# EAGLE design pokey (EAGLE 6.6.0)

## Sheet 1 of 7: Paddles
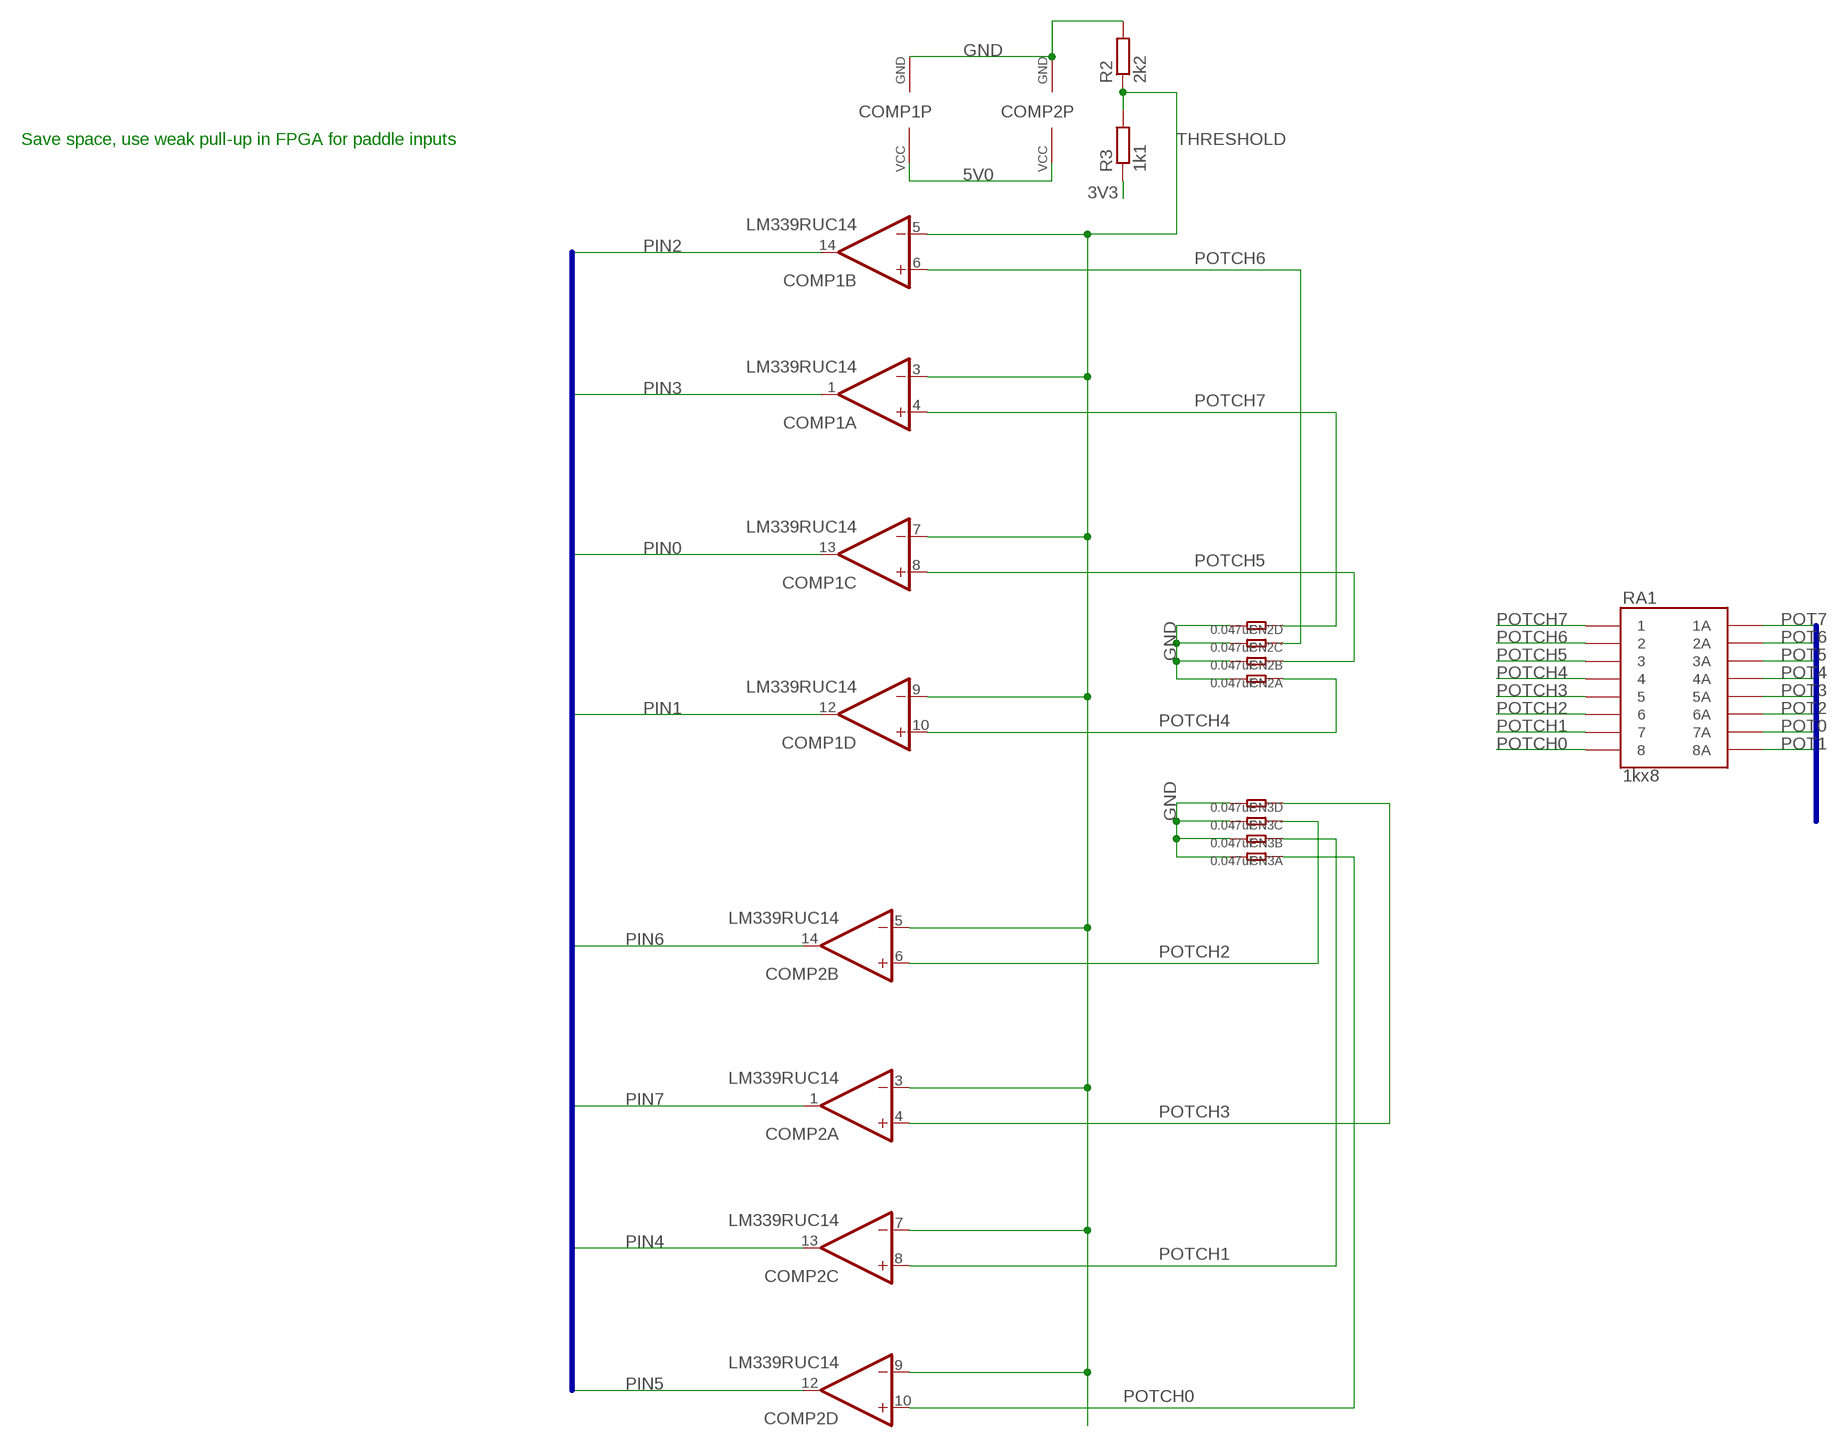
[diagram p0: schematic, sheet 1]

### Parts
CN2  0.047uF  R-4R  [R1206-8]
CN3  0.047uF  R-4R  [R1206-8]
COMP1  LM339RUC14  [RUC14]
COMP2  LM339RUC14  [RUC14]
R2  2k2  R-EU_R0603  [R0603]
R3  1k1  R-EU_R0603  [R0603]
RA1  1kx8  CAY16-J8  [CAY16-J8]

### Nets
3V3: R3.1 ; also sheet 2,3,4,7
5V0: COMP1.2(P:VCC) COMP2.2(P:VCC) ; also sheet 3,4,5,7
GND: CN2.5 CN2.6 CN2.7 CN2.8 CN3.5 CN3.6 CN3.7 CN3.8 COMP1.11(P:GND) COMP2.11(P:GND) R2.2 ; also sheet 2,3,4,5,6,7
PIN0: COMP1.13(C:OUT) ; also sheet 2
PIN1: COMP1.12(D:OUT) ; also sheet 2
PIN2: COMP1.14(B:OUT) ; also sheet 2
PIN3: COMP1.1(A:OUT) ; also sheet 2
PIN4: COMP2.13(C:OUT) ; also sheet 2
PIN5: COMP2.12(D:OUT) ; also sheet 2
PIN6: COMP2.14(B:OUT) ; also sheet 2
PIN7: COMP2.1(A:OUT) ; also sheet 2
POT0: RA1.P$10(7A) ; also sheet 3
POT1: RA1.P$9(8A) ; also sheet 3
POT2: RA1.P$11(6A) ; also sheet 3
POT3: RA1.P$12(5A) ; also sheet 3
POT4: RA1.P$13(4A) ; also sheet 3
POT5: RA1.P$14(3A) ; also sheet 3
POT6: RA1.P$15(2A) ; also sheet 3
POT7: RA1.P$16(1A) ; also sheet 3
POTCH0: CN3.1 COMP2.10(D:+IN) RA1.P$8 ; also sheet 3
POTCH1: CN3.2 COMP2.8(C:+IN) RA1.P$7 ; also sheet 3
POTCH2: CN3.3 COMP2.6(B:+IN) RA1.P$6 ; also sheet 3
POTCH3: CN3.4 COMP2.4(A:+IN) RA1.P$5 ; also sheet 3
POTCH4: CN2.1 COMP1.10(D:+IN) RA1.P$4 ; also sheet 3
POTCH5: CN2.2 COMP1.8(C:+IN) RA1.P$3 ; also sheet 3
POTCH6: CN2.3 COMP1.6(B:+IN) RA1.P$2 ; also sheet 3
POTCH7: CN2.4 COMP1.4(A:+IN) RA1.P$1 ; also sheet 3
THRESHOLD: COMP1.3(A:-IN) COMP1.5(B:-IN) COMP1.7(C:-IN) COMP1.9(D:-IN) COMP2.3(A:-IN) COMP2.5(B:-IN) COMP2.7(C:-IN) COMP2.9(D:-IN) R2.1 R3.2

### Buses
POT[0..7]
PIN[0..7]

### Notes on the sheet
- Save space, use weak pull-up in FPGA for paddle inputs

## Sheet 2 of 7: FPGA
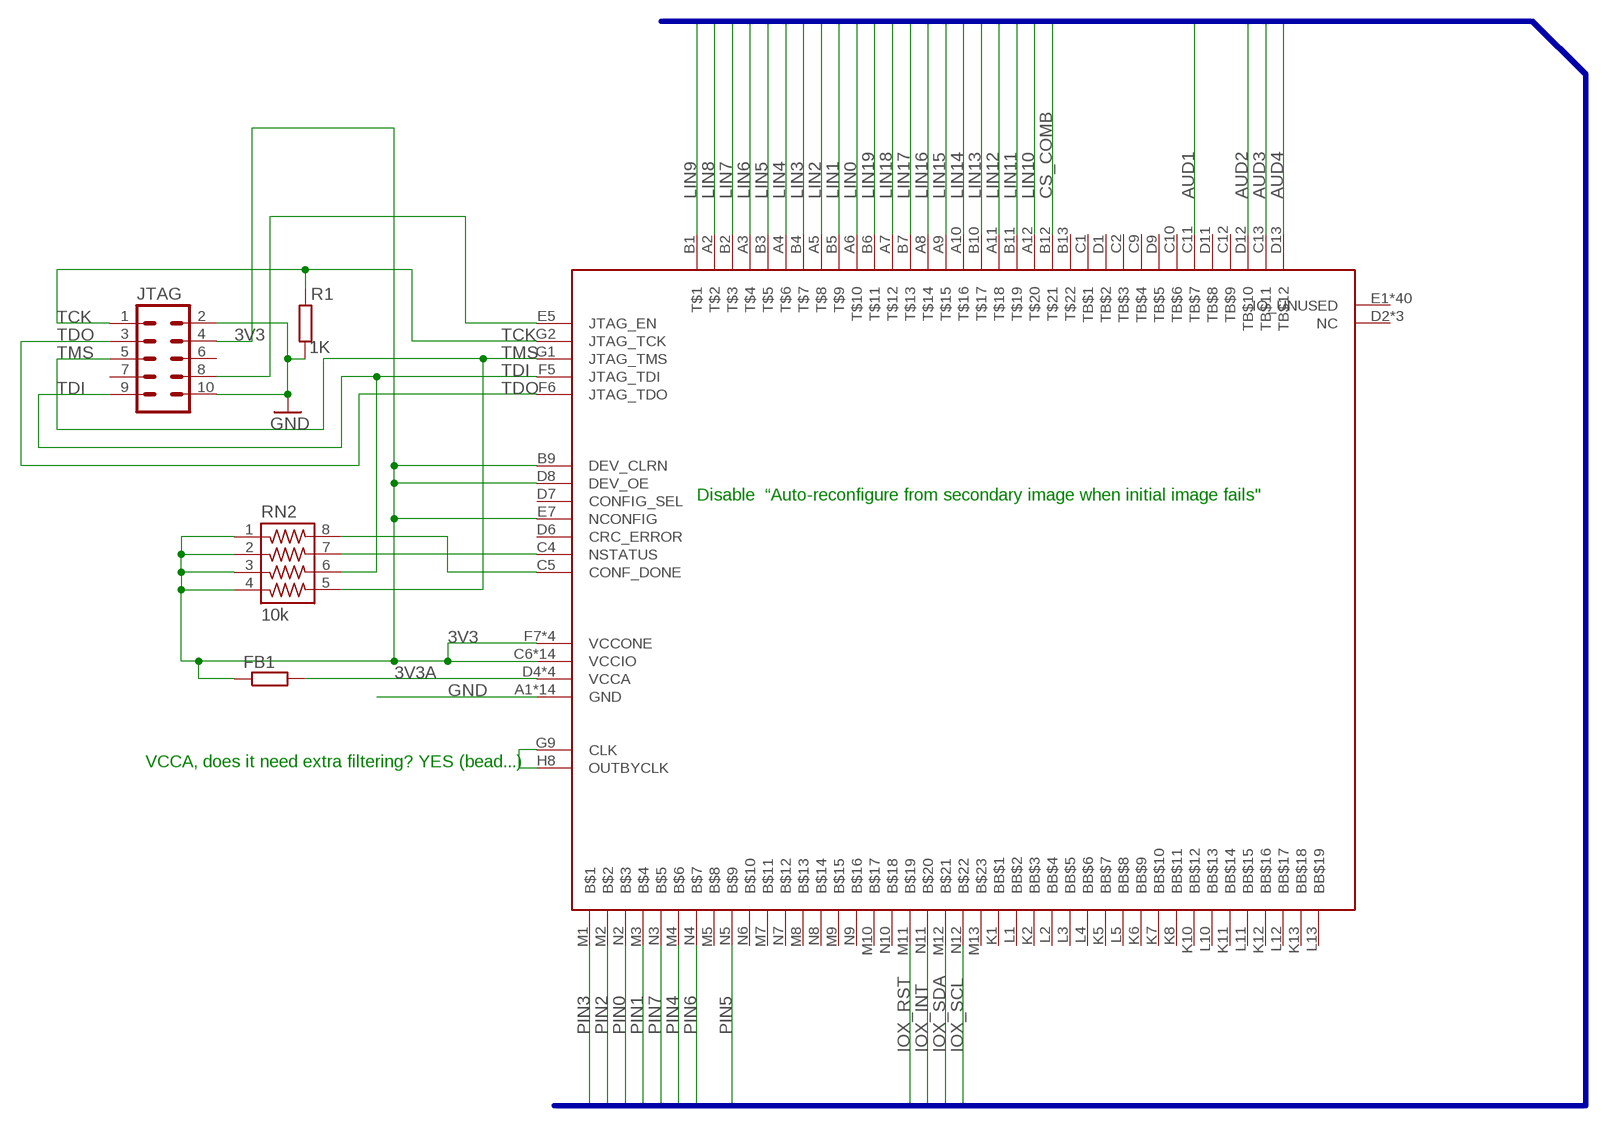
[diagram p1: schematic, sheet 2]

### Parts
FB1  R-EU_R0603  [R0603]
JTAG  ML10  [ML10]
MAX10  MAX10  [U169SMALL]
R1  1K  R-EU_R0603  [R0603]
RN2  10k  742-8  [742-8]

### Nets
3V3: FB1.1 JTAG.4 MAX10.B9(DEV_CLRN) MAX10.C6(VCCIO) MAX10.C7(VCCIO) MAX10.C8(VCCIO) MAX10.D8(DEV_OE) MAX10.E7(NCONFIG) MAX10.F2(VCCIO) MAX10.F7(VCCONE) MAX10.F11(VCCIO) MAX10.G3(VCCIO) MAX10.G6(VCCONE) MAX10.G8(VCCONE) MAX10.G11(VCCIO) MAX10.H7(VCCONE) MAX10.H11(VCCIO) MAX10.J3(VCCIO) MAX10.J11(VCCIO) MAX10.K3(VCCIO) MAX10.L6(VCCIO) MAX10.L7(VCCIO) MAX10.L8(VCCIO) RN2.1 RN2.2 RN2.3 RN2.4 ; also sheet 1,3,4,7
3V3A: FB1.2 MAX10.D4(VCCA) MAX10.D10(VCCA) MAX10.K4(VCCA) MAX10.K9(VCCA) ; also sheet 7
AUD1: MAX10.C11(TB$7) ; also sheet 6
AUD2: MAX10.D12(TB$10) ; also sheet 6
AUD3: MAX10.C13(TB$11) ; also sheet 6
AUD4: MAX10.D13(TB$12) ; also sheet 6
CONF_DONE: MAX10.C5(CONF_DONE) RN2.8
CS_COMB: MAX10.B12(T$21) ; also sheet 3
FAKE_CLK: MAX10.G9(CLK) MAX10.H8(OUTBYCLK)
GND: JTAG.2 JTAG.10 MAX10.A1(GND) MAX10.A13(GND) MAX10.B8(GND) MAX10.C3(GND) MAX10.D5(GND) MAX10.E11(GND) MAX10.F3(GND) MAX10.G7(GND) MAX10.H12(GND) MAX10.J4(GND) MAX10.L9(GND) MAX10.M6(GND) MAX10.N1(GND) MAX10.N13(GND) R1.2 ; also sheet 1,3,4,5,6,7
IOX_INT: MAX10.N11(B$20) ; also sheet 3
IOX_RST: MAX10.M11(B$19) ; also sheet 3
IOX_SCL: MAX10.N12(B$22) ; also sheet 3
IOX_SDA: MAX10.M12(B$21) ; also sheet 3
JTAGEN: JTAG.8 MAX10.E5(JTAG_EN)
LIN0: MAX10.A6(T$10) ; also sheet 3
LIN1: MAX10.B5(T$9) ; also sheet 3
LIN2: MAX10.A5(T$8) ; also sheet 3
LIN3: MAX10.B4(T$7) ; also sheet 3
LIN4: MAX10.A4(T$6) ; also sheet 3
LIN5: MAX10.B3(T$5) ; also sheet 3
LIN6: MAX10.A3(T$4) ; also sheet 3
LIN7: MAX10.B2(T$3) ; also sheet 3
LIN8: MAX10.A2(T$2) ; also sheet 3
LIN9: MAX10.B1(T$1) ; also sheet 3
LIN10: MAX10.A12(T$20) ; also sheet 3
LIN11: MAX10.B11(T$19) ; also sheet 3
LIN12: MAX10.A11(T$18) ; also sheet 3
LIN13: MAX10.B10(T$17) ; also sheet 3
LIN14: MAX10.A10(T$16) ; also sheet 3
LIN15: MAX10.A9(T$15) ; also sheet 3
LIN16: MAX10.A8(T$14) ; also sheet 3
LIN17: MAX10.B7(T$13) ; also sheet 3
LIN18: MAX10.A7(T$12) ; also sheet 3
LIN19: MAX10.B6(T$11) ; also sheet 3
NSTATUS: MAX10.C4(NSTATUS) RN2.7
PIN0: MAX10.N2(B$3) ; also sheet 1
PIN1: MAX10.M3(B$4) ; also sheet 1
PIN2: MAX10.M2(B$2) ; also sheet 1
PIN3: MAX10.M1(B$1) ; also sheet 1
PIN4: MAX10.M4(B$6) ; also sheet 1
PIN5: MAX10.N5(B$9) ; also sheet 1
PIN6: MAX10.N4(B$7) ; also sheet 1
PIN7: MAX10.N3(B$5) ; also sheet 1
TCK: JTAG.1 MAX10.G2(JTAG_TCK) R1.1
TDI: JTAG.9 MAX10.F5(JTAG_TDI) RN2.6
TDO: JTAG.3 MAX10.F6(JTAG_TDO)
TMS: JTAG.5 MAX10.G1(JTAG_TMS) RN2.5
Unconnected: JTAG.6 JTAG.7 MAX10.B13(T$22) MAX10.C1(TB$1) MAX10.C2(TB$3) MAX10.C9(TB$4) MAX10.C10(TB$6) MAX10.C12(TB$9) MAX10.D1(TB$2) MAX10.D2(NC) MAX10.D3(NC) MAX10.D6(CRC_ERROR) MAX10.D7(CONFIG_SEL) MAX10.D9(TB$5) MAX10.D11(TB$8) MAX10.E1(IO_UNUSED) MAX10.E2(NC) MAX10.E3(IO_UNUSED) MAX10.E4(IO_UNUSED) MAX10.E6(IO_UNUSED) MAX10.E8(IO_UNUSED) MAX10.E9(IO_UNUSED) MAX10.E10(IO_UNUSED) MAX10.E12(IO_UNUSED) MAX10.E13(IO_UNUSED) MAX10.F1(IO_UNUSED) MAX10.F4(IO_UNUSED) MAX10.F8(IO_UNUSED) MAX10.F9(IO_UNUSED) MAX10.F10(IO_UNUSED) MAX10.F12(IO_UNUSED) MAX10.F13(IO_UNUSED) MAX10.G4(IO_UNUSED) MAX10.G5(IO_UNUSED) MAX10.G10(IO_UNUSED) MAX10.G12(IO_UNUSED) MAX10.G13(IO_UNUSED) MAX10.H1(IO_UNUSED) MAX10.H2(IO_UNUSED) MAX10.H3(IO_UNUSED) MAX10.H4(IO_UNUSED) MAX10.H5(IO_UNUSED) MAX10.H6(IO_UNUSED) MAX10.H9(IO_UNUSED) MAX10.H10(IO_UNUSED) MAX10.H13(IO_UNUSED) MAX10.J1(IO_UNUSED) MAX10.J2(IO_UNUSED) MAX10.J5(IO_UNUSED) MAX10.J6(IO_UNUSED) MAX10.J7(IO_UNUSED) MAX10.J8(IO_UNUSED) MAX10.J9(IO_UNUSED) MAX10.J10(IO_UNUSED) MAX10.J12(IO_UNUSED) MAX10.J13(IO_UNUSED) MAX10.K1(BB$1) MAX10.K2(BB$3) MAX10.K5(BB$7) MAX10.K6(BB$9) MAX10.K7(BB$10) MAX10.K8(BB$11) MAX10.K10(BB$12) MAX10.K11(BB$14) MAX10.K12(BB$16) MAX10.K13(BB$18) MAX10.L1(BB$2) MAX10.L2(BB$4) MAX10.L3(BB$5) MAX10.L4(BB$6) MAX10.L5(BB$8) MAX10.L10(BB$13) MAX10.L11(BB$15) MAX10.L12(BB$17) MAX10.L13(BB$19) MAX10.M5(B$8) MAX10.M7(B$11) MAX10.M8(B$13) MAX10.M9(B$15) MAX10.M10(B$17) MAX10.M13(B$23) MAX10.N6(B$10) MAX10.N7(B$12) MAX10.N8(B$14) MAX10.N9(B$16) MAX10.N10(B$18)

### Buses
LIN[0..19],PIN[0..7],IOX_SCL,IOX_SDA,IOX_INT,IOX_RST,AUD[1..4],CS_COMB

### Notes on the sheet
- Disable  “Auto-reconfigure from secondary image when initial image fails"
- VCCA, does it need extra filtering? YES (bead...)

## Sheet 3 of 7: Level conv
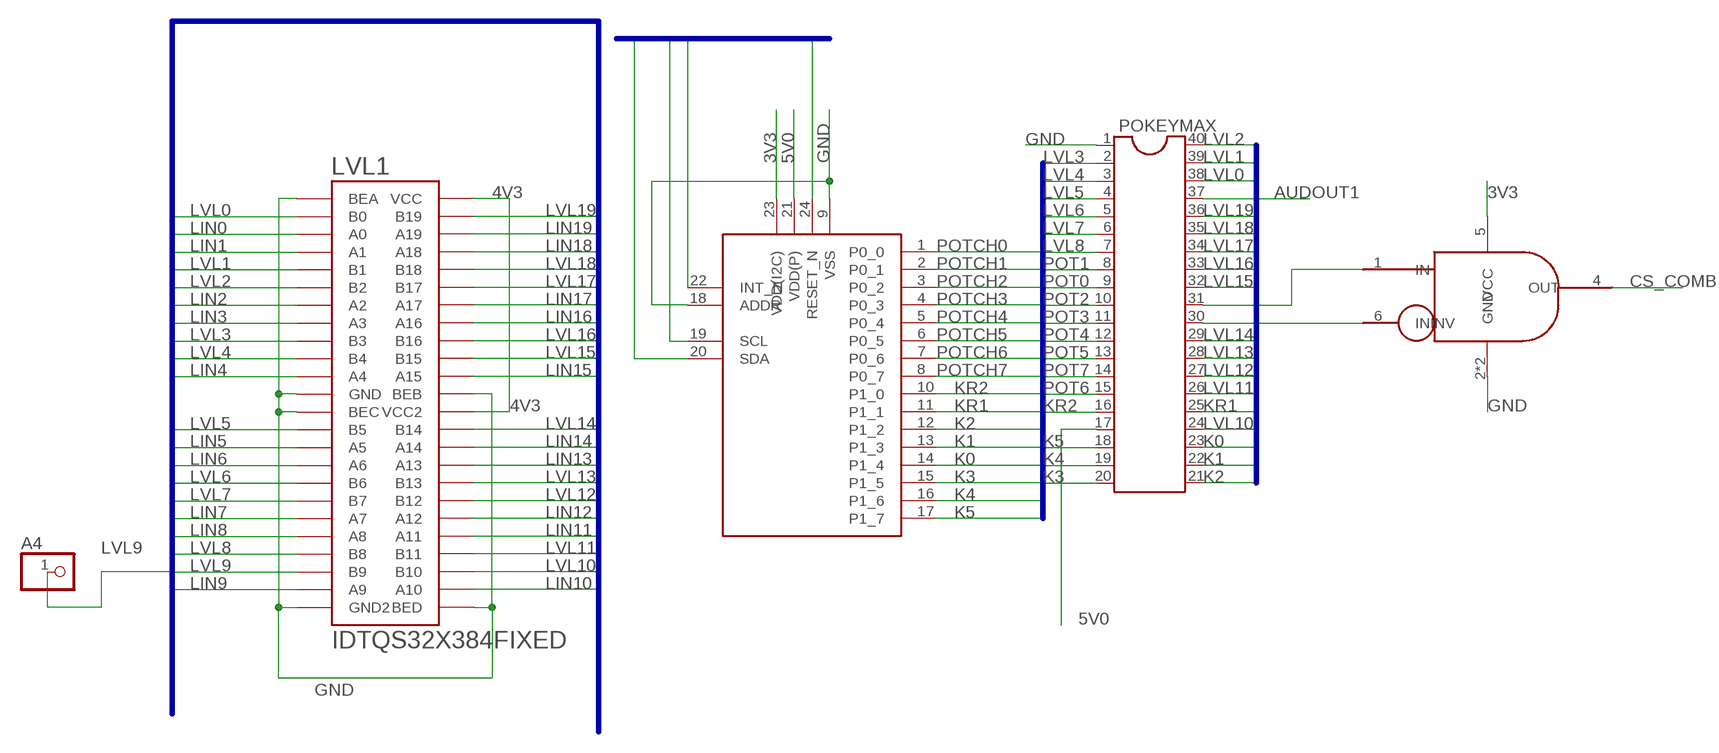
[diagram p2: schematic, sheet 3]

### Parts
A4  PINHD-1X1  [1X01]
AND1  AND_INV  [SOT-23-6]
IOEXT  PCAL6416A  [QFN-24]
LVL1  IDTQS32X384FIXED  [IDTQS32X384_04MM]
POKEYMAX  DIL40  [DIL40]

### Nets
3V3: AND1.5(VCC) IOEXT.23(VDD(I2C)) ; also sheet 1,2,4,7
4V3: LVL1.P$36(VCC2) LVL1.P$48(VCC) ; also sheet 5
5V0: IOEXT.21(VDD(P)) POKEYMAX.17 ; also sheet 1,4,5,7
AUDOUT1: POKEYMAX.37 ; also sheet 6
CS_COMB: AND1.4(OUT) ; also sheet 2
GND: AND1.2(GND) AND1.3(GND) IOEXT.9(VSS) IOEXT.18(ADDR) LVL1.P$1(BEA) LVL1.P$12(GND) LVL1.P$13(BEC) LVL1.P$24(GND2) LVL1.P$25(BED) LVL1.P$37(BEB) POKEYMAX.1 ; also sheet 1,2,4,5,6,7
IOX_INT: IOEXT.22(INT_N) ; also sheet 2
IOX_RST: IOEXT.24(RESET_N) ; also sheet 2
IOX_SCL: IOEXT.19(SCL) ; also sheet 2
IOX_SDA: IOEXT.20(SDA) ; also sheet 2
K0: IOEXT.14(P1_4) POKEYMAX.23
K1: IOEXT.13(P1_3) POKEYMAX.22
K2: IOEXT.12(P1_2) POKEYMAX.21
K3: IOEXT.15(P1_5) POKEYMAX.20
K4: IOEXT.16(P1_6) POKEYMAX.19
K5: IOEXT.17(P1_7) POKEYMAX.18
KR1: IOEXT.11(P1_1) POKEYMAX.25
KR2: IOEXT.10(P1_0) POKEYMAX.16
LIN0: LVL1.P$3(A0) ; also sheet 2
LIN1: LVL1.P$4(A1) ; also sheet 2
LIN2: LVL1.P$7(A2) ; also sheet 2
LIN3: LVL1.P$8(A3) ; also sheet 2
LIN4: LVL1.P$11(A4) ; also sheet 2
LIN5: LVL1.P$15(A5) ; also sheet 2
LIN6: LVL1.P$16(A6) ; also sheet 2
LIN7: LVL1.P$19(A7) ; also sheet 2
LIN8: LVL1.P$20(A8) ; also sheet 2
LIN9: LVL1.P$23(A9) ; also sheet 2
LIN10: LVL1.P$26(A10) ; also sheet 2
LIN11: LVL1.P$29(A11) ; also sheet 2
LIN12: LVL1.P$30(A12) ; also sheet 2
LIN13: LVL1.P$33(A13) ; also sheet 2
LIN14: LVL1.P$34(A14) ; also sheet 2
LIN15: LVL1.P$38(A15) ; also sheet 2
LIN16: LVL1.P$41(A16) ; also sheet 2
LIN17: LVL1.P$42(A17) ; also sheet 2
LIN18: LVL1.P$45(A18) ; also sheet 2
LIN19: LVL1.P$46(A19) ; also sheet 2
LVL0: LVL1.P$2(B0) POKEYMAX.38
LVL1: LVL1.P$5(B1) POKEYMAX.39
LVL2: LVL1.P$6(B2) POKEYMAX.40
LVL3: LVL1.P$9(B3) POKEYMAX.2
LVL4: LVL1.P$10(B4) POKEYMAX.3
LVL5: LVL1.P$14(B5) POKEYMAX.4
LVL6: LVL1.P$17(B6) POKEYMAX.5
LVL7: LVL1.P$18(B7) POKEYMAX.6
LVL8: LVL1.P$21(B8) POKEYMAX.7
LVL9: A4.1 LVL1.P$22(B9)
LVL10: LVL1.P$27(B10) POKEYMAX.24
LVL11: LVL1.P$28(B11) POKEYMAX.26
LVL12: LVL1.P$31(B12) POKEYMAX.27
LVL13: LVL1.P$32(B13) POKEYMAX.28
LVL14: LVL1.P$35(B14) POKEYMAX.29
LVL15: LVL1.P$39(B15) POKEYMAX.32
LVL16: LVL1.P$40(B16) POKEYMAX.33
LVL17: LVL1.P$43(B17) POKEYMAX.34
LVL18: LVL1.P$44(B18) POKEYMAX.35
LVL19: LVL1.P$47(B19) POKEYMAX.36
N$15: AND1.1(IN) POKEYMAX.31
N$16: AND1.6(ININV) POKEYMAX.30
POT0: POKEYMAX.9 ; also sheet 1
POT1: POKEYMAX.8 ; also sheet 1
POT2: POKEYMAX.10 ; also sheet 1
POT3: POKEYMAX.11 ; also sheet 1
POT4: POKEYMAX.12 ; also sheet 1
POT5: POKEYMAX.13 ; also sheet 1
POT6: POKEYMAX.15 ; also sheet 1
POT7: POKEYMAX.14 ; also sheet 1
POTCH0: IOEXT.1(P0_0) ; also sheet 1
POTCH1: IOEXT.2(P0_1) ; also sheet 1
POTCH2: IOEXT.3(P0_2) ; also sheet 1
POTCH3: IOEXT.4(P0_3) ; also sheet 1
POTCH4: IOEXT.5(P0_4) ; also sheet 1
POTCH5: IOEXT.6(P0_5) ; also sheet 1
POTCH6: IOEXT.7(P0_6) ; also sheet 1
POTCH7: IOEXT.8(P0_7) ; also sheet 1

### Buses
LVL[0..19],KR[1..2],K[0..5]
LIN[0..19],LVL[0..19]
LVL[0..31],POT[0..7],POTCH[0..7],KR[1..2],K[0..5]
IOX_SCL,IOX_SDA,IOX_INT,IOX_RST

## Sheet 4 of 7: Power regs
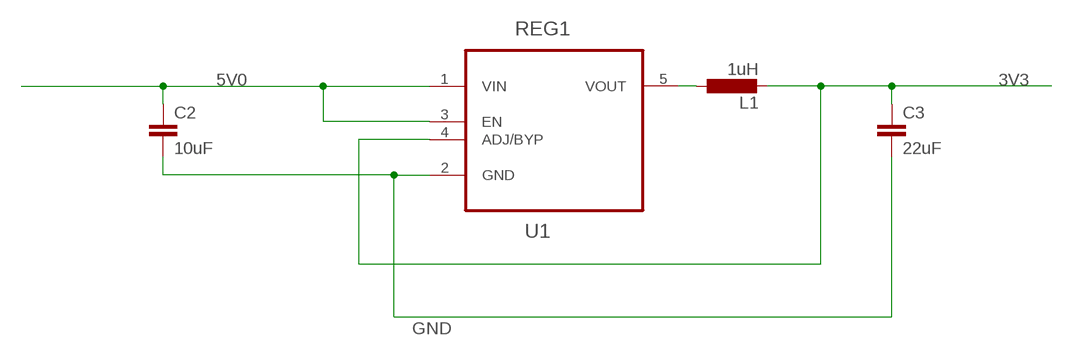
[diagram p3: schematic, sheet 4]

### Parts
C2  10uF  C-EUC0805  [C0805]
C3  22uF  C-EUC0805  [C0805]
L1  1uH  L-EUL3225M  [L3225M]
REG1  U1  SPX3819M5-L-5-0  [SOT95P280X145-5N]

### Nets
3V3: C3.1 L1.2 REG1.4(ADJ/BYP) ; also sheet 1,2,3,7
5V0: C2.1 REG1.1(VIN) REG1.3(EN) ; also sheet 1,3,5,7
GND: C2.2 C3.2 REG1.2(GND) ; also sheet 1,2,3,5,6,7
N$137: L1.1 REG1.5(VOUT)

## Sheet 5 of 7: Level conv power
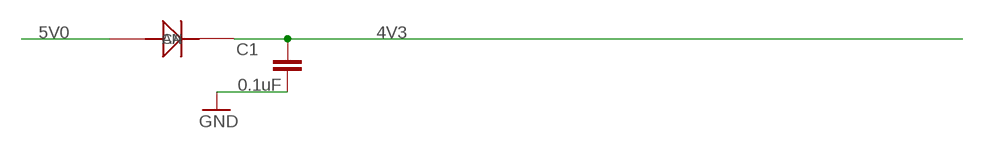
[diagram p4: schematic, sheet 5]

### Parts
C1  0.1uF  C-EUC0603  [C0603]
D1  1N4148  [SOD123]

### Nets
4V3: C1.2 D1.1(CA) ; also sheet 3
5V0: D1.2(AN) ; also sheet 1,3,4,7
GND: C1.1 ; also sheet 1,2,3,4,6,7

## Sheet 6 of 7: Audio filter
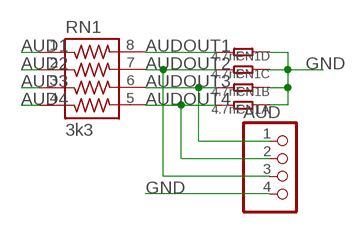
[diagram p5: schematic, sheet 6]

### Parts
AUD  PINHD-1X4  [1X04]
CN1  4.7nF  R-4R  [R1206-8]
RN1  3k3  742-8  [742-8]

### Nets
AUD1: RN1.1 ; also sheet 2
AUD2: RN1.2 ; also sheet 2
AUD3: RN1.3 ; also sheet 2
AUD4: RN1.4 ; also sheet 2
AUDOUT1: CN1.5 RN1.8 ; also sheet 3
AUDOUT2: AUD.3 CN1.6 RN1.7
AUDOUT3: AUD.1 CN1.7 RN1.6
AUDOUT4: AUD.2 CN1.8 RN1.5
GND: AUD.4 CN1.1 CN1.2 CN1.3 CN1.4 ; also sheet 1,2,3,4,5,7

## Sheet 7 of 7: Decoupling
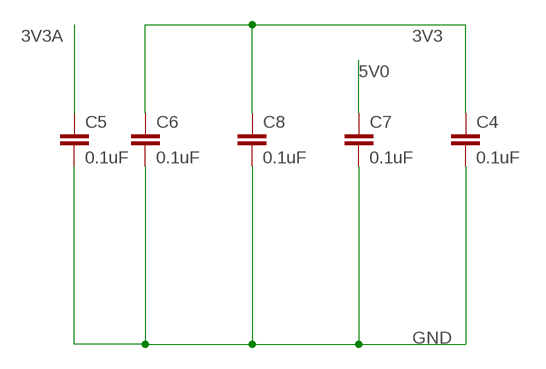
[diagram p6: schematic, sheet 7]

### Parts
C4  0.1uF  C-EUC0603  [C0603]
C5  0.1uF  C-EUC0603  [C0603]
C6  0.1uF  C-EUC0603  [C0603]
C7  0.1uF  C-EUC0603  [C0603]
C8  0.1uF  C-EUC0603  [C0603]

### Nets
3V3: C4.1 C6.1 C8.1 ; also sheet 1,2,3,4
3V3A: C5.1 ; also sheet 2
5V0: C7.1 ; also sheet 1,3,4,5
GND: C4.2 C5.2 C6.2 C7.2 C8.2 ; also sheet 1,2,3,4,5,6

## Library data of the parts
A4 = pinhead:PINHD-1X1: PIN HEADER
AND1 = max10:AND_INV
AUD = max10:PINHD-1X4: PIN HEADER
C1 = resistor:C-EU: CAPACITOR, European symbol
C2-C8 = rcl:C-EU: CAPACITOR, European symbol
CN1-CN3 = Discrete:R-4R*: Resistor Array
COMP1 COMP2 = max10:LM339: Based on information from the SLCS006N datasheet from TI (www.ti.com). Change Log Date Author Change July 16, 2008 nick@scantool.net Device created.
D1 = quickswitch:1N4148
FB1 R1-R3 = rcl:R-EU_: RESISTOR, European symbol
IOEXT = max10:PCAL6416A
JTAG = con-ml:ML10: HARTING; OC_FARNELL: unknown; OC_NEWARK: unknown
L1 = rcl:L-EU: INDUCTOR, European symbol
LVL1 = IDT:IDTQS32X384
MAX10 = max10:MAX10
POKEYMAX = ic-package:DIL40: Dual In Line
RA1 = CAY16-J8:CAY16-J8
REG1 = Exar_By_element14_Batch_1:SPX3819M5-L-5-0: 500mA, LOW-NOISE LDO VOLTAGE REGULATOR; MPN: SPX3819M5-L-5-0; OC_FARNELL: 1829408; OC_NEWARK: 84R4417; PACKAGE: SOT-23-5; SUPPLIER: EXAR
RN1 RN2 = resistor-array:742-8: CTS 742 Series 8 Terminations, 4 Resistors

## Board
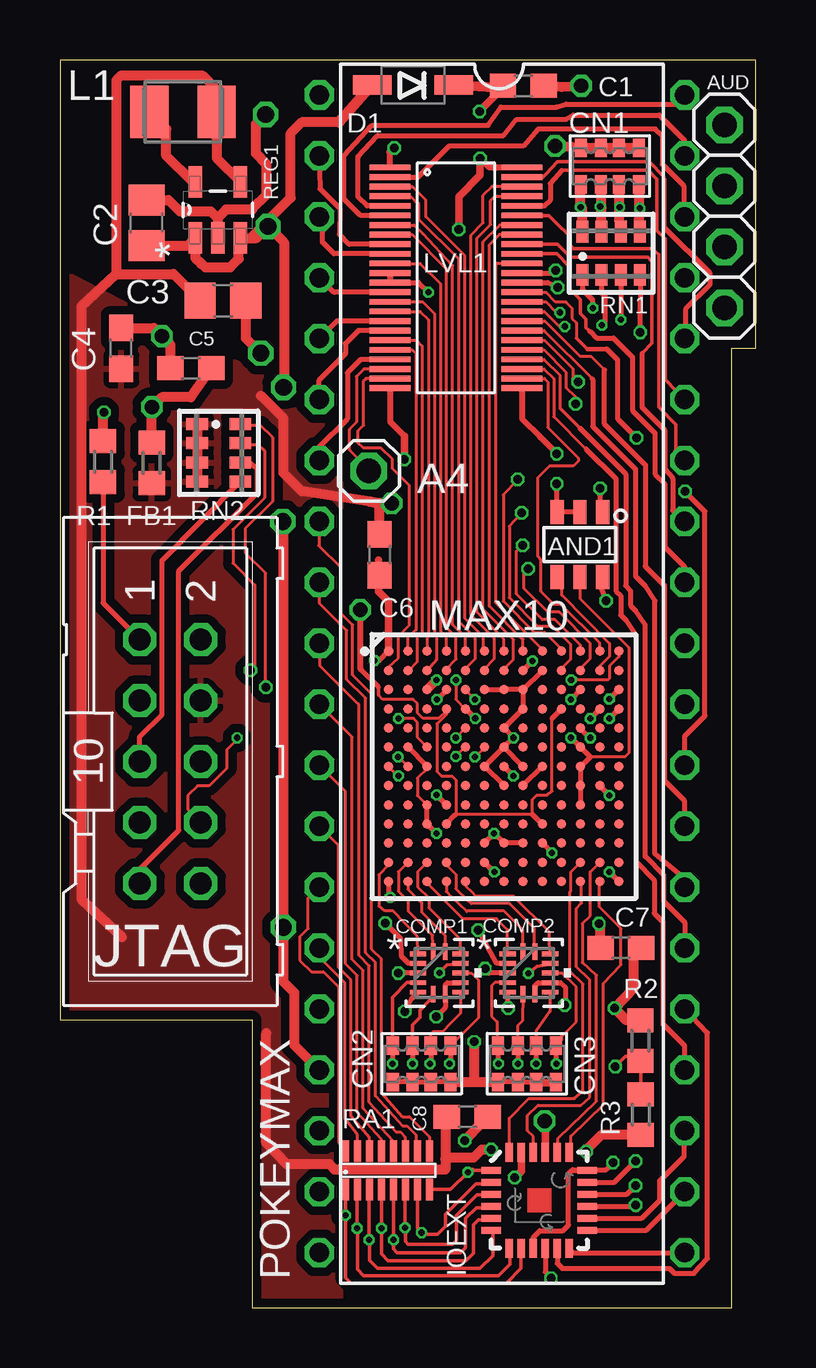
[diagram p7: board, top side]
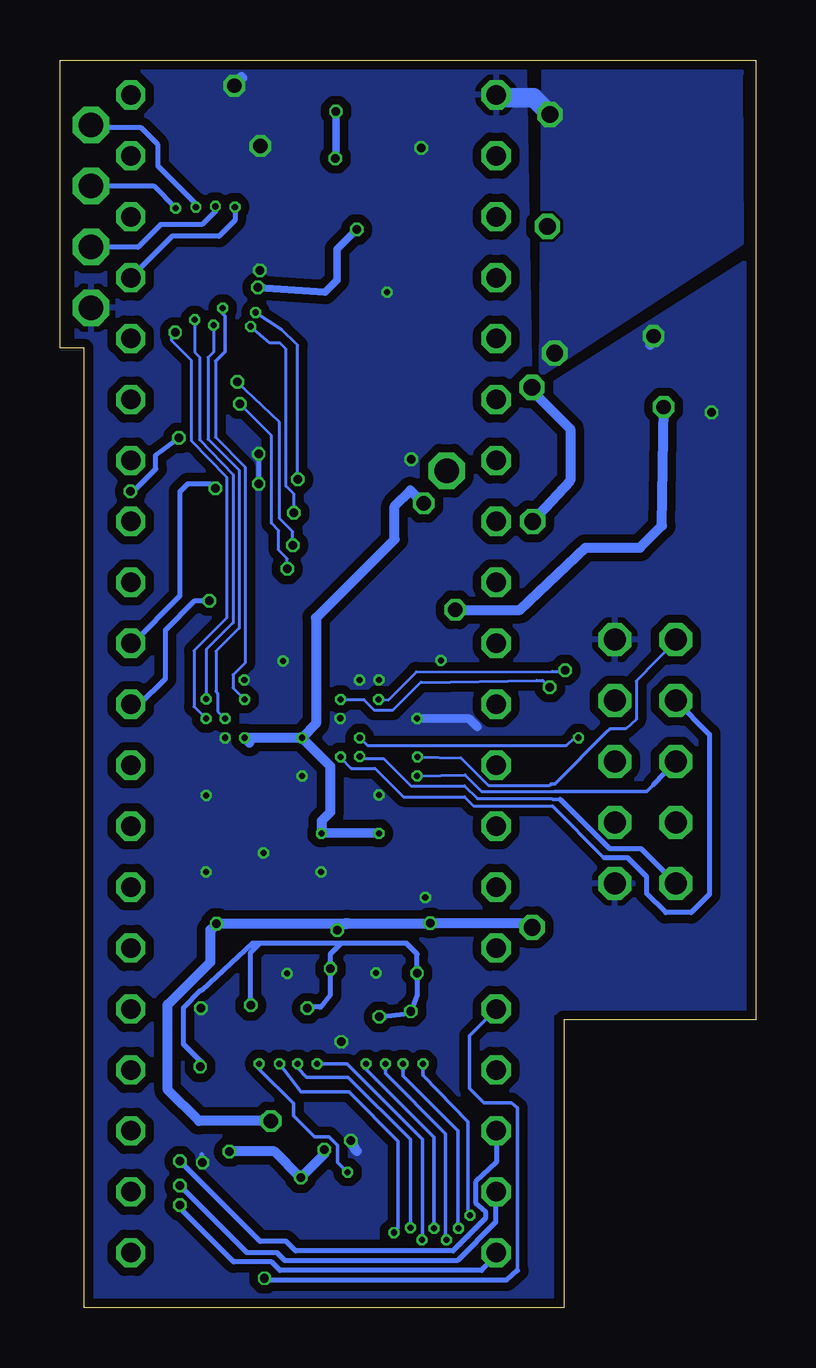
[diagram p8: board, bottom side, seen from below]

Size 29 x 52 mm. Coordinates in mm from the lower left corner, seen from the top.
Outline: 29,52 0,52 0,12 8,12 8,0 28,0 28,40 29,40 29,52
Copper layers (1*16): Top 0.035559375mm / dielectric 0.17018125mm / Bottom 0.035559375mm
Design rules "OSHPark-4layer_as2layer *": minimum track width 5mil, minimum drill 10mil, track to track 5mil, track to pad 5mil, pad to pad 5mil, via to via 5mil, smd to smd 5mil, copper to edge 15mil, drill to drill 6mil, minimum pad ring 4mil, minimum via ring 4mil, stop-mask expansion 4mil, vias tented up to drill 15mil, thermal gap 10mil

### Footprints (pad centres in the part's own frame; a part is rotated, then mirrored left to right if it is on the bottom)
1X01 = drill 1.016 octagon: 1 0,0
SOT-23-6 = smd 1 x 0.55: 1 -1.35,0.95; 2 -1.35,0; 3 -1.35,-0.95; 4 1.35,-0.95; 5 1.35,0; 6 1.35,0.95
1X04 = drill 1.016 octagon: 1 -3.81,0; 2 -1.27,0; 3 1.27,0; 4 3.81,0
C0603 = smd 1.1 x 1: 1 -0.85,0; 2 0.85,0
C0805 = smd 1.3 x 1.5: 1 -0.95,0; 2 0.95,0
R1206-8 = smd 0.508 x 0.762: 1 -1.206,-0.762; 2 -0.381,-0.762; 3 0.381,-0.762; 4 1.206,-0.762; 5 1.206,0.762; 6 0.381,0.762; 7 -0.381,0.762; 8 -1.206,0.762
RUC14 = smd 0.68 x 0.2: 1 -0.885,0.8; 2 -0.885,0.4; 3 -0.885,0; 4 -0.885,-0.4; 5 -0.885,-0.8; 8 0.885,-0.8; 9 0.885,-0.4; 10 0.885,0; 11 0.885,0.4; 12 0.885,0.8 | smd 0.2 x 0.68: 6 -0.25,-0.885; 7 0.25,-0.885; 13 0.25,0.885; 14 -0.25,0.885
SOD123 = smd 1.6 x 0.8: 1 -1.7,0; 2 1.7,0
R0603 = smd 1 x 1.1: 1 -0.85,0; 2 0.85,0
QFN-24 = smd 0.8 x 0.3: 1 -2,1.25; 2 -2,0.75; 3 -2,0.25; 4 -2,-0.25; 5 -2,-0.75; 6 -2,-1.25; 13 2,-1.25; 14 2,-0.75; 15 2,-0.25; 16 2,0.25; 17 2,0.75; 18 2,1.25 | smd 0.3 x 0.8: 7 -1.25,-2; 8 -0.75,-2; 9 -0.25,-2; 10 0.25,-2; 11 0.75,-2; 12 1.25,-2; 19 1.25,2; 20 0.75,2; 21 0.25,2; 22 -0.25,2; 23 -0.75,2; 24 -1.25,2
ML10 = drill 0.914 octagon: 1 -5.08,-1.27; 2 -5.08,1.27; 3 -2.54,-1.27; 4 -2.54,1.27; 5 0,-1.27; 6 0,1.27; 7 2.54,-1.27; 8 2.54,1.27; 9 5.08,-1.27; 10 5.08,1.27
L3225M = smd 1.6 x 2.2: 1 -1.4,0; 2 1.4,0
IDTQS32X384_04MM = smd 0.24 x 1.7: P$1 -4.6,-2.51; P$2 -4.2,-2.51; P$3 -3.8,-2.51; P$4 -3.4,-2.51; P$5 -3,-2.51; P$6 -2.6,-2.51; P$7 -2.2,-2.51; P$8 -1.8,-2.51; P$9 -1.4,-2.51; P$10 -1,-2.51; P$11 -0.6,-2.51; P$12 -0.2,-2.51; P$13 0.2,-2.51; P$14 0.6,-2.51; P$15 1,-2.51; P$16 1.4,-2.51; P$17 1.8,-2.51; P$18 2.2,-2.51; P$19 2.6,-2.51; P$20 3,-2.51; P$21 3.4,-2.51; P$22 3.8,-2.51; P$23 4.2,-2.51; P$24 4.6,-2.51; P$25 4.6,2.99; P$26 4.2,2.99; P$27 3.8,2.99; P$28 3.4,2.99; P$29 3,2.99; P$30 2.6,2.99; P$31 2.2,2.99; P$32 1.8,2.99; P$33 1.4,2.99; P$34 1,2.99; P$35 0.6,2.99; P$36 0.2,2.99; P$37 -0.2,2.99; P$38 -0.6,2.99; P$39 -1,2.99; P$40 -1.4,2.99; P$41 -1.8,2.99; P$42 -2.2,2.99; P$43 -2.6,2.99; P$44 -3,2.99; P$45 -3.4,2.99; P$46 -3.8,2.99; P$47 -4.2,2.99; P$48 -4.6,2.99
U169SMALL = smd 0.4 x 0.4: A1 -4.8,4.8; A2 -4,4.8; A3 -3.2,4.8; A4 -2.4,4.8; A5 -1.6,4.8; A6 -0.8,4.8; A7 0,4.8; A8 0.8,4.8; A9 1.6,4.8; A10 2.4,4.8; A11 3.2,4.8; A12 4,4.8; A13 4.8,4.8; B1 -4.8,4; B2 -4,4; B3 -3.2,4; B4 -2.4,4; B5 -1.6,4; B6 -0.8,4; B7 0,4; B8 0.8,4; B9 1.6,4; B10 2.4,4; B11 3.2,4; B12 4,4; B13 4.8,4; C1 -4.8,3.2; C2 -4,3.2; C3 -3.2,3.2; C4 -2.4,3.2; C5 -1.6,3.2; C6 -0.8,3.2; C7 0,3.2; C8 0.8,3.2; C9 1.6,3.2; C10 2.4,3.2; C11 3.2,3.2; C12 4,3.2; C13 4.8,3.2; D1 -4.8,2.4; D2 -4,2.4; D3 -3.2,2.4; D4 -2.4,2.4; D5 -1.6,2.4; D6 -0.8,2.4; D7 0,2.4; D8 0.8,2.4; D9 1.6,2.4; D10 2.4,2.4; D11 3.2,2.4; D12 4,2.4; D13 4.8,2.4; E1 -4.8,1.6; E2 -4,1.6; E3 -3.2,1.6; E4 -2.4,1.6; E5 -1.6,1.6; E6 -0.8,1.6; E7 0,1.6; E8 0.8,1.6; E9 1.6,1.6; E10 2.4,1.6; E11 3.2,1.6; E12 4,1.6; E13 4.8,1.6; F1 -4.8,0.8; F2 -4,0.8; F3 -3.2,0.8; F4 -2.4,0.8; F5 -1.6,0.8; F6 -0.8,0.8; F7 0,0.8; F8 0.8,0.8; F9 1.6,0.8; F10 2.4,0.8; F11 3.2,0.8; F12 4,0.8; F13 4.8,0.8; G1 -4.8,0; G2 -4,0; G3 -3.2,0; G4 -2.4,0; G5 -1.6,0; G6 -0.8,0; G7 0,0; G8 0.8,0; G9 1.6,0; G10 2.4,0; G11 3.2,0; G12 4,0; G13 4.8,0; H1 -4.8,-0.8; H2 -4,-0.8; H3 -3.2,-0.8; H4 -2.4,-0.8; H5 -1.6,-0.8; H6 -0.8,-0.8; H7 0,-0.8; H8 0.8,-0.8; H9 1.6,-0.8; H10 2.4,-0.8; H11 3.2,-0.8; H12 4,-0.8; H13 4.8,-0.8; J1 -4.8,-1.6; J2 -4,-1.6; J3 -3.2,-1.6; J4 -2.4,-1.6; J5 -1.6,-1.6; J6 -0.8,-1.6; J7 0,-1.6; J8 0.8,-1.6; J9 1.6,-1.6; J10 2.4,-1.6; J11 3.2,-1.6; J12 4,-1.6; J13 4.8,-1.6; K1 -4.8,-2.4; K2 -4,-2.4; K3 -3.2,-2.4; K4 -2.4,-2.4; K5 -1.6,-2.4; K6 -0.8,-2.4; K7 0,-2.4; K8 0.8,-2.4; K9 1.6,-2.4; K10 2.4,-2.4; K11 3.2,-2.4; K12 4,-2.4; K13 4.8,-2.4; L1 -4.8,-3.2; L2 -4,-3.2; L3 -3.2,-3.2; L4 -2.4,-3.2; L5 -1.6,-3.2; L6 -0.8,-3.2; L7 0,-3.2; L8 0.8,-3.2; L9 1.6,-3.2; L10 2.4,-3.2; L11 3.2,-3.2; L12 4,-3.2; L13 4.8,-3.2; M1 -4.8,-4; M2 -4,-4; M3 -3.2,-4; M4 -2.4,-4; M5 -1.6,-4; M6 -0.8,-4; M7 0,-4; M8 0.8,-4; M9 1.6,-4; M10 2.4,-4; M11 3.2,-4; M12 4,-4; M13 4.8,-4; N1 -4.8,-4.8; N2 -4,-4.8; N3 -3.2,-4.8; N4 -2.4,-4.8; N5 -1.6,-4.8; N6 -0.8,-4.8; N7 0,-4.8; N8 0.8,-4.8; N9 1.6,-4.8; N10 2.4,-4.8; N11 3.2,-4.8; N12 4,-4.8; N13 4.8,-4.8
DIL40 = drill 0.813 octagon: 1 -24.13,-7.62; 2 -21.59,-7.62; 3 -19.05,-7.62; 4 -16.51,-7.62; 5 -13.97,-7.62; 6 -11.43,-7.62; 7 -8.89,-7.62; 8 -6.35,-7.62; 9 -3.81,-7.62; 10 -1.27,-7.62; 11 1.27,-7.62; 12 3.81,-7.62; 13 6.35,-7.62; 14 8.89,-7.62; 15 11.43,-7.62; 16 13.97,-7.62; 17 16.51,-7.62; 18 19.05,-7.62; 19 21.59,-7.62; 20 24.13,-7.62; 21 24.13,7.62; 22 21.59,7.62; 23 19.05,7.62; 24 16.51,7.62; 25 13.97,7.62; 26 11.43,7.62; 27 8.89,7.62; 28 6.35,7.62; 29 3.81,7.62; 30 1.27,7.62; 31 -1.27,7.62; 32 -3.81,7.62; 33 -6.35,7.62; 34 -8.89,7.62; 35 -11.43,7.62; 36 -13.97,7.62; 37 -16.51,7.62; 38 -19.05,7.62; 39 -21.59,7.62; 40 -24.13,7.62
CAY16-J8 = smd 0.3 x 0.9: P$1 0.15,-1.175; P$2 0.65,-1.175; P$3 1.15,-1.175; P$4 1.65,-1.175; P$5 2.15,-1.175; P$6 2.65,-1.175; P$7 3.15,-1.175; P$8 3.65,-1.175; P$9 3.65,0.425; P$10 3.15,0.425; P$11 2.65,0.425; P$12 2.15,0.425; P$13 1.65,0.425; P$14 1.15,0.425; P$15 0.65,0.425; P$16 0.15,0.425
SOT95P280X145-5N = smd 1.321 x 0.559: 1 -1.168,0.94; 2 -1.168,0; 3 -1.168,-0.94; 4 1.168,-0.94; 5 1.168,0.94
742-8 = smd 0.5 x 0.9: 1 -1.2,-0.9; 2 -0.4,-0.9; 3 0.4,-0.9; 4 1.2,-0.9; 5 1.2,0.9; 6 0.4,0.9; 7 -0.4,0.9; 8 -1.2,0.9

### Placement (x,y rotation side)
A4  12.88,34.87 0 top
AND1  21.68,31.8 270 top
AUD  27.7,45.48 270 top
C1  19.32,50.92 180 top
C2  3.61,45.21 90 top
C3  6.8,41.96 0 top
C4  2.55,39.98 90 top
C5  5.46,39.15 180 top
C6  13.33,31.38 270 top
C7  23.38,14.99 0 top
C8  16.98,7.95 0 top
CN1  22.93,47.57 180 top
CN2  15.08,10.16 180 top
CN3  19.47,10.16 180 top
COMP1  15.81,13.94 0 top
COMP2  19.55,13.94 0 top
D1  14.72,50.96 180 top
FB1  3.83,35.2 90 top
IOEXT  19.98,4.47 0 top
JTAG  4.6,22.76 270 top
L1  5.13,49.83 0 top
LVL1  16.27,42.92 270 top
MAX10  18.51,22.56 0 top
POKEYMAX  18.43,26.42 270 top
R1  1.79,35.26 90 top
R2  24.2,11.13 90 top
R3  24.21,8.04 90 top
RA1  11.75,6.1 0 top
REG1  6.58,45.75 90 top
RN1  22.98,43.94 0 top
RN2  6.62,35.63 270 top

### Tracks (layer width: path | path; a pad name or v marks a point on that pad's centre or on a via)
3V3  (via drill 0.25, 0.36, 0.6)
  Top 0.127: MAX10.F11 21.71,23.5 | MAX10.C6 17.59,25.75 | MAX10.G3 15.31,22.45 14.9,22.07 14.9,21.34 MAX10.J3 | AND1.5 21.68,29.55 23.71,27.51 23.71,23.11 23.56,22.95 22.11,22.95 | 15.31,20.09 MAX10.K3 15.31,20.27 | MAX10.L8 19.44,19.36
  Top 0.203: MAX10.G8 MAX10.F7 | MAX10.F7 MAX10.G6 MAX10.H7 | MAX10.C8 MAX10.B9 | MAX10.G3 | v21.3,23.75 21.31,23.75 MAX10.F11 | MAX10.F7 v18.9,23.75 v18.91,23.75 MAX10.E7 MAX10.D8 MAX10.C8 | MAX10.F11 22.11,22.95 MAX10.G11 MAX10.H11 MAX10.J11 | MAX10.F11 | MAX10.C8 MAX10.C7 MAX10.C6 | 19.4,19.36 MAX10.L8 MAX10.L7 | MAX10.F2 MAX10.G3 | 15.26,20.09 15.31,20.09 15.37,20.09 v15.7,19.76 | 15.31,20.27 MAX10.J3 | MAX10.L6 v18.1,19.76 MAX10.L7 | MAX10.L7
  Top 0.305: IOEXT.23 19.23,5.68 v18.96,5.41
  Top 0.406: 2.35,43.08 2.35,51.16 2.53,51.33 5.96,51.33 6.53,50.76 L1.2 6.53,47.91 REG1.4 | 5.87,41.59 C3.1 4.73,43.08 2.35,43.08 | 2.58,15.44 0.91,17.02 0.91,41.73 2.35,43.08 | RN2.1 RN2.2 RN2.3 RN2.4 | 16.07,6.18 16.07,5.74 11.45,5.74 11.45,5.77 11.24,5.97 9.44,5.97 8.6,6.86 8.6,11.43 | C6.1 13.33,33.46 12.92,33.59 | 12.92,33.59 v13.83,33.52 | v17.97,6.58 17.58,6.58 17.25,6.25 16.14,6.25 16.07,6.18 | 12.92,33.59 10.08,34.03 9.32,34.79 9.32,37.07 8.38,38.01 | C8.1 16.07,7.89 16.07,6.18 | v21.94,6.5 21.94,6.55 22.58,7.19 R3.1
  Bottom 0.406: v17.97,6.58 17.97,6.4 v18.96,5.41 20.06,6.5 v21.94,6.5 | v18.91,23.75 v21.3,23.75 21.1,23.55 | v13.83,33.52 14.39,34.06 15.05,33.4 15.05,32.01 17.47,29.6 18.32,28.74 18.32,24.34 v18.91,23.75 | v15.7,19.76 18.07,19.79 | 18.07,19.79 v18.1,19.76 | 18.07,19.79 18.07,20.3 17.72,20.65 MAX10.G6 v18.91,23.75
  pour Top (isolate 0.356, rank 6): 0.65,42.9 9.62,38.23 9.95,38.23 9.95,51.31 11.7,51.31 11.7,0.1 8.4,0.1 8.4,12.19 0.45,12.19 0.45,43
3V3A  (via drill 0.6)
  Top 0.127: MAX10.K9 20.07,20.16 20.07,20.18 | 20.51,24.54 20.51,21.51 20.31,21.36 19.88,21.36 19.7,21.18 19.7,20.55 16.48,20.55 16.5,20.57 16.5,22 16.35,22.15 15.92,22.15 15.71,22.35 15.71,24.33 16.11,24.73 MAX10.D4 16.11,24.85 15.79,24.56 15.14,24.56 14.9,24.79 14.9,25.17 14.72,25.35 13.45,25.35 13.28,25.53
  Top 0.152: 13.28,25.53 13.28,25.86
  Top 0.203: 13.28,25.86 12.54,26.59 | 12.54,28.78 v12.51,29.08 | 20.07,20.18 19.7,20.55 | MAX10.K4 16.48,20.52 16.48,20.55 | MAX10.D10 20.51,24.56 20.51,24.54
  Top 0.254: 12.54,26.59 12.54,28.78
  Top 0.406: C5.1 5.45,37.95 4.25,37.95 v3.83,37.53 FB1.2
  Bottom 0.406: v12.51,29.08 9.82,29.08 7.08,31.67 4.82,31.67 3.9,32.59 v3.83,37.53
4V3  (via drill 0.36)
  Top 0.203: 18.47,50.85 18.47,50.84 | 17.64,47.78 v17.52,47.9 | LVL1.P$36 20.34,42.72 v20.74,42.52
  Top 0.254: LVL1.P$48 17.9,47.52 v17.52,47.9
  Top 0.305: 18.47,50.84 v17.49,49.86 | v17.52,47.9 17.52,47.19 16.63,46.3 v16.63,44.93
  Top 0.406: D1.1 18.47,50.85 C1.2
  Bottom 0.203: 17.49,47.93 v17.52,47.9
  Bottom 0.305: v17.49,49.86 17.49,47.93 | v16.63,44.93 17.44,44.12 17.44,42.82 17.95,42.32 v20.74,42.52
5V0  (via drill 0.36, 0.6, 0.7)
  Top 0.203: COMP1.2 14.53,14.35 14.24,14.63 14.21,15.37 v13.55,16.03 | COMP2.2 18.2,14.35 v17.44,15.72
  Top 0.305: v20.21,7.77 20.23,7.75 IOEXT.21
  Top 0.406: C2.1 5.33,44.26 REG1.1 5.64,43.75 5.88,43.51 5.91,43.51 6.06,43.36 7.1,43.36 7.46,43.71 7.46,44.52 REG1.3 7.94,44.58 | 7.94,44.58 9.62,46.25 9.62,48.95 10.07,49.4 11.63,49.4 D1.2 | 7.94,44.58 8.2,44.58 v8.68,45.06 9.34,44.4 9.34,38.18 v9.32,38.35 | 9.34,15.88 v9.31,15.85 | v9.31,15.85 9.31,13.59 9.77,13.13 9.77,10.95 POKEYMAX.17 | v9.29,32.77 9.29,15.87 v9.31,15.85 | C7.1 22.53,15.94 v22.47,16
  Bottom 0.203: 17.07,15.99 16.93,16
  Bottom 0.406: 20.34,7.77 v20.21,7.77 23.21,7.77 24.5,9.07 24.5,12.65 24.43,12.7 22.72,14.4 22.72,15.75 v22.47,16 17.09,16 17.07,15.99 | v9.31,15.85 9.62,16 13.53,16 v13.55,16.03 13.66,16 16.93,16 17.16,16 v17.44,15.72 | v9.32,38.35 9.32,38.22 7.73,36.62 7.73,34.48 v9.29,32.77
AUD1  (via drill 0.25)
  Top 0.203: MAX10.C11 v21.3,25.35 | RN1.1 21.78,42.42 22.22,41.99 v22.22,41.66
  Bottom 0.127: 22.52,39.45 22.52,36.27 21.28,35.03 21.28,26.87 21.78,26.36 21.78,25.83 v21.3,25.35
  Bottom 0.152: 22.52,39.45 22.11,39.85 22.11,41.33 22.22,41.43 v22.22,41.66
AUD2  (via drill 0.25)
  Top 0.203: MAX10.D12 22.51,24.94 v22.11,24.55 | RN1.2 22.58,42.31 22.72,42.16 22.72,41.07 v22.6,40.95
  Bottom 0.127: v22.6,40.95 22.6,39.83 22.82,39.6 22.82,36.2 21.53,34.9 21.53,28.32 22.5,27.36 22.5,25.68 22.42,25.6 22.42,24.85 v22.11,24.55
AUD3  (via drill 0.25)
  Top 0.203: MAX10.C13 | MAX10.C13 v22.9,25.36 v22.9,25.35 | RN1.3 v23.38,41.18 v23.38,41.17
  Bottom 0.127: v23.38,41.17 23.38,39.83 23.18,39.62 23.18,36.17 21.78,34.72 21.78,28.52 21.81,28.52 22.9,27.43 v22.9,25.36
AUD4  (via drill 0.25, 0.36)
  Top 0.203: v24.2,40.64 24.22,43.38 RN1.4 | MAX10.D13 23.31,24.94 v22.91,24.55
  Bottom 0.127: v22.91,24.55 23.41,25.04 23.41,27.38 22.04,28.75 22.04,34.59 23.51,36.12 23.51,39.47 24.35,40.31 24.35,40.49 v24.2,40.64
AUDOUT1  (via drill 0.25)
  Top 0.406: RN1.8 21.78,45.8 v21.71,45.87 21.71,46.8 CN1.5
  Bottom 0.203: v21.71,45.87 21.71,45.31 22.37,44.65 24.32,44.65 POKEYMAX.37
AUDOUT2  (via drill 0.25)
  Top 0.406: RN1.7 22.58,45.84 v22.52,45.9 22.55,45.92 CN1.6
  Bottom 0.203: v22.52,45.9 22.52,45.7 23.08,45.14 24.81,45.14 25.75,44.2 25.76,44.21 AUD.3
AUDOUT3  (via drill 0.25)
  Top 0.203: v23.33,45.87 23.33,45.39 23.31,45.37
  Top 0.406: CN1.7 23.31,45.37 RN1.6
  Bottom 0.203: v23.33,45.87 23.33,46 24.91,47.57 24.91,48.46 25.62,49.17 27.59,49.17 AUD.1
AUDOUT4  (via drill 0.25)
  Top 0.203: 24.13,45.34 24.13,45.78 v24.17,45.82
  Top 0.406: CN1.8 24.13,45.34 RN1.5
  Bottom 0.203: v24.17,45.82 25.1,46.75 AUD.2
CONF_DONE  (via drill 0.25, 0.36)
  Top 0.127: MAX10.C5 16.91,25.73 v17.3,25.35 | v8.58,25.86 8.58,30.6 7.73,31.45 7.73,32.46 8.86,33.59 8.86,36.27 8.37,36.75 7.43,36.75 RN2.8
  Bottom 0.127: 17.24,25.32 v17.3,25.35 17.27,25.32 16.32,25.32 15.89,24.89 15.13,24.89 13.96,26.06 13.91,26.06 9.13,26.14 8.88,26.14 v8.58,25.86
CS_COMB
  Top 0.127: 22.51,26.66 MAX10.B12 22.51,26.73 22.91,27.14 22.91,27.69 20.92,29.69 20.92,30.26 AND1.4
FAKE_CLK
  Top 0.203: MAX10.G9 MAX10.H8
GND  (via drill 0.25, 0.36, 0.6, 0.7)
  Top 0.127: MAX10.A13 23.31,27.13 22.91,26.75 22.91,26.23 22.85,26.16 v21.31,26.16 | v14.11,24.55 14.1,24.56 14.75,24.56 14.9,24.38 14.9,23.76 MAX10.F3 | v16.51,26.15 16.5,25.35 16.88,24.94 16.91,24.94 17.34,24.51 | v19.52,13.92 19.65,14.05 | 20.39,14.3 COMP2.11
  Top 0.152: v15.82,13.95 16.14,14.28 COMP1.11 | 20.39,14.3 19.88,14.22 v19.52,13.92
  Top 0.203: CN3.8 CN3.7 | CN3.5 CN3.6 CN3.7 | CN2.8 CN2.7 CN2.6 CN2.5 | IOEXT.9 19.73,2.92 20.01,3.2 20.97,3.2 21.2,3.43 21.2,5.56 21.35,5.71 | 21.35,5.71 IOEXT.18 | CN3.7 19.93,9.32 20.69,9.32 | 21.35,5.71 21.38,5.74 22.77,5.74 23.08,6.04 v23.05,6.04 | MAX10.N13 v22.91,18.15 | MAX10.L9 v20.51,18.95 | MAX10.M6 18.1,18.16 v18.11,18.15 | MAX10.G7 18.51,22.54 v18.9,22.15 | MAX10.J4 | MAX10.J4 v15.7,21.36 | MAX10.E11 21.71,24.12 v22.11,23.75 | MAX10.A13 23.4,27.36 | MAX10.N1 13.71,17.13 v13.77,17.09 | MAX10.B8 v19.7,26.95 | v15.7,26.16 15.69,26.14 | MAX10.D5 v17.31,24.56 | AND1.2 AND1.3 20.73,34.1 v20.72,34.34 | v13.12,26.98 13.33,26.98 MAX10.A1 | MAX10.H12 22.51,21.74 v22.9,21.35 | LVL1.P$13 14.96,42.72 v15.36,42.32 | LVL1.P$37 20.55,43.12 v20.67,43.23
  Top 0.254: v20.72,35.59 20.03,36.27 19.26,37.04 LVL1.P$25 | LVL1.P$1 13.76,48.16 | LVL1.P$12 LVL1.P$13 | LVL1.P$24 13.76,36.93 14.36,36.33
  Top 0.305: C6.2 13.28,31.16 13.28,29.85 13.71,29.42 MAX10.A1 | 13.76,48.16 v13.94,48.34 | v14.36,35.35 14.36,36.33
  Top 0.356: MAX10.C3 15.7,26.15 v15.7,26.16
  Top 0.406: C2.2 4.53,46.16 4.99,45.7 6.29,45.7 6.57,45.41 | 6.57,45.41 6.57,44.59 REG1.2 | 6.57,45.41 6.92,45.77 8.02,45.77 8.02,45.8 8.63,46.41 8.6,46.43 8.6,47.68 8.17,48.11 8.17,49.33 v8.58,49.73 | C3.2 7.75,40.4 v8.37,39.78 | C1.1 20.92,50.88 v21.73,50.93 | CN1.4 CN1.3 CN1.2 CN1.1 | CN1.4 22.62,48.34 | CN1.4 v20.64,48.41 | CN2.8 17.26,9.4 | 17.26,9.4 CN3.5 | v17.26,11.07 17.26,9.4 | C7.2 23.91,14.99 23.91,13.28 v23.13,12.48 23.6,11.97 R2.2 | R1.2 1.79,37.27 v1.83,37.31 | C4.2 3.91,40.83 v4.25,40.49 4.61,40.13 C5.2 | MAX10.A1 | C8.2 17.8,7.95 v16.88,6.96
  Bottom 0.203: v13.94,48.34 14.04,48.34 14.09,48.39 | v23.05,6.04 23.08,6.38 | v20.72,35.59 v20.72,34.34
  Bottom 0.356: 11.6,24.21 11.95,24.56 12.03,24.56 12.04,24.55 v14.11,24.55
  Bottom 0.406: v21.73,50.93 21.4,51.26 21.43,51.28 | POKEYMAX.1 10.33,50.55 10.2,50.42 | v4.25,40.49 4.25,40.27 4.41,40.12 | v16.88,6.96 16.67,6.57 16.63,6.53
  Bottom 0.813: 10.68,50.42 10.2,50.42 9.26,50.42 v8.58,49.73
  pour Bottom (isolate 0.356, rank 6): 9.62,51.54 28.3,51.54 28.3,0.23 8.5,0.23 8.5,12.29 0.45,12.29 0.47,43.56 9.39,37.9 9.39,38.13
  pour Bottom: 0.6,44.35 8.93,38.91 8.83,51.66 0.6,51.54 0.6,51.41 0.63,51.41 0.63,51.38
IOX_INT
  Top 0.127: IOEXT.22 19.73,7.13 19.5,7.37 19.5,8 19.93,8.43 21.73,8.43 22.09,8.77 22.09,13.66 21.51,14.22 21.51,16.62 21.75,16.86 21.75,17.72 MAX10.N11 21.66,17.7
IOX_RST
  Top 0.127: IOEXT.24 18.73,7.89 19.55,8.71 21.46,8.71 21.81,9.02 21.81,13.49 21.25,14.02 21.25,17.3 21.3,17.35 21.3,18.15 MAX10.M11
IOX_SCL
  Top 0.127: IOEXT.19 21.3,6.54 21.3,7.14 22.65,8.46 22.65,13.51 23.39,14.29 23.39,15.8 22.47,16.71 22.47,17.72 MAX10.N12
IOX_SDA
  Top 0.127: IOEXT.20 20.77,6.51 20.77,7.06 22.37,8.6 22.37,13.85 21.78,14.38 21.78,16 22.11,16.33 22.11,18.16 MAX10.M12
JTAGEN  (via drill 0.25)
  Top 0.127: v16.5,23.75 | v16.5,23.75 MAX10.E5 | v7.38,23.75 7.38,23.67 6.95,23.24 6.95,22.48 6.21,21.74 5.73,21.74 5.33,21.34 5.33,20.76 JTAG.8
  Bottom 0.127: v16.5,23.75 16.17,23.42 7.89,23.42 7.56,23.75 v7.38,23.75
K0
  Top 0.203: POKEYMAX.23 26.03,7.34 26.03,6.3 25.01,5.28 25.01,4.47 24.26,3.72 IOEXT.14
K1
  Top 0.203: POKEYMAX.22 24.45,3.22 IOEXT.13
K2
  Top 0.203: POKEYMAX.21 26.03,2.27 21.43,2.27 IOEXT.12
K3  (via drill 0.36)
  Top 0.203: 23.99,4.06 v23.99,4.27 23.95,4.22 IOEXT.15
  Bottom 0.203: v23.99,4.27 23.99,4.14 21.76,1.91 20.18,1.91 19.83,1.55 11.42,1.55 10.81,2.16 POKEYMAX.20
K4  (via drill 0.36)
  Top 0.203: IOEXT.16 23.63,4.72 v23.99,5.08
  Bottom 0.203: POKEYMAX.19 10.84,4.83 10.84,3.56 12.44,1.96 19.62,1.96 19.95,2.29 21.2,2.29 v23.99,5.08
K5  (via drill 0.36)
  Top 0.203: IOEXT.17 23.12,5.22 v23.99,6.1
  Bottom 0.203: POKEYMAX.18 10.81,6.04 11.68,5.23 11.68,4.37 11.27,4.01 11.27,3.71 12.61,2.36 19.17,2.36 19.57,2.77 20.61,2.77 20.64,2.74 v23.99,6.1
KR1
  Top 0.203: POKEYMAX.25 26.99,11.46 26.99,2.03 26.43,1.42 25.62,1.42 25.42,1.63 20.95,1.63 20.73,1.84 IOEXT.11
KR2  (via drill 0.36)
  Top 0.203: IOEXT.10 20.23,1.49 v20.47,1.22
  Bottom 0.152: 9.92,1.55 9.92,8.33 10.18,8.53 11.32,8.53 11.93,9.14 11.93,11.33 POKEYMAX.16
  Bottom 0.203: 9.92,1.55 10.38,1.14 20.39,1.14 v20.47,1.22
LIN0
  Top 0.127: 13.72,46.76 LVL1.P$3 14.69,46.72 15.26,46.15 15.26,45.47 16.88,43.84 16.88,28.73 17.64,27.96 17.64,27.42 MAX10.A6
LIN1
  Top 0.127: MAX10.B5 16.91,26.64 17.31,27.05 17.31,27.91 16.63,28.6 16.63,43.69 14.95,45.36 14.95,45.97 | 14.95,46.02 14.95,45.97 | LVL1.P$4 14.61,46.32 14.95,45.97
LIN2
  Top 0.127: MAX10.A5 16.91,27.94 16.37,28.47 16.37,43.43 15.13,44.76 14.76,45.12 LVL1.P$7
LIN3
  Top 0.127: MAX10.B4 16.11,26.61 16.51,27.03 16.51,27.95 16.12,28.35 16.12,43.28 14.67,44.73 14.66,44.72 LVL1.P$8
LIN4
  Top 0.127: MAX10.A4 16.11,27.95 15.87,28.19 15.87,42.67 15.02,43.52 LVL1.P$11
LIN5
  Top 0.127: MAX10.B3 15.71,27.03 15.71,27.96 15.61,28.07 15.61,41.43 15.12,41.92 LVL1.P$15
LIN6
  Top 0.127: MAX10.A3 15.31,27.89 15.36,27.94 15.36,41.17 15.01,41.52 LVL1.P$16
LIN7
  Top 0.127: MAX10.B2 14.56,26.55 14.9,26.92 14.9,27.94 15.1,28.14 15.1,40.08 14.87,40.32 LVL1.P$19
LIN8
  Top 0.127: MAX10.A2 14.51,27.94 14.85,28.26 14.85,39.75 14.7,39.9 13.78,39.9 LVL1.P$20
LIN9
  Top 0.127: MAX10.B1 13.71,26.7 14.11,27.08 14.11,27.98 14.54,28.42 14.54,34.29 13.86,34.98 13.86,35.35 13.38,35.83 12.65,35.83 12.44,36.04 12.44,36.55 12.66,36.78 12.64,36.8 12.64,38.61 12.75,38.72 LVL1.P$23
LIN10
  Top 0.127: MAX10.A12 22.51,27.7 20.89,29.31 20.59,29.31 20.06,29.84 20.06,31.17 19.93,31.29 19.93,34.59 20.41,35.08 21.4,35.08 21.61,35.28 21.61,35.41 20.34,36.68 20.34,38.58 20.2,38.72 LVL1.P$26
LIN11  (via drill 0.36)
  Top 0.127: MAX10.B11 21.71,26.64 22.11,27.05 22.11,27.69 20.82,28.98 20.34,28.98 19.34,29.97 19.34,30.61 v19.52,30.79 | LVL1.P$29 20.17,39.92 21.1,38.99 21.1,38.35 21.5,37.95 v21.5,37.67
  Bottom 0.127: v19.52,30.79 19.52,31.22 19.88,31.57 19.88,32.38 20.18,32.69 20.18,36.35 v21.5,37.67
LIN12  (via drill 0.36)
  Top 0.127: MAX10.A11 21.71,27.61 20.64,28.68 20.11,28.68 19.04,29.74 19.04,31.52 v19.3,31.77 | LVL1.P$30 20.2,40.32 21.38,39.14 21.38,38.73 v21.61,38.58
  Bottom 0.127: v19.3,31.77 19.3,32.33 19.85,32.89 19.85,36.91 v21.61,38.58
LIN13  (via drill 0.25, 0.36)
  Top 0.127: MAX10.B10 20.91,26.63 21.3,27.03 21.3,27.64 20.54,28.4 19.9,28.4 18.74,29.59 18.74,32.56 v19.24,33.12 | LVL1.P$33 20.19,41.52 20.82,40.89 v21.05,40.89
  Bottom 0.127: v19.24,33.12 19.24,33.91 19.57,34.24 19.57,39.95 19.83,40.21 20.23,40.21 v21.05,40.89
LIN14  (via drill 0.25, 0.36)
  Top 0.127: v19.09,34.52 18.48,33.88 18.48,29.44 19.78,28.14 20.21,28.14 20.91,27.45 MAX10.A10 | LVL1.P$34 20.25,41.92 20.69,41.48 v20.84,41.48
  Bottom 0.127: v19.09,34.52 19.09,40.11 19.75,40.77 v20.84,41.48
LIN15
  Top 0.127: 20.11,27.41 MAX10.A9 20.11,27.43 18.15,29.39 18.15,43.46 18.21,43.52 LVL1.P$38
LIN16
  Top 0.127: MAX10.A8 19.31,27.85 19.3,27.86 19.27,27.86 17.9,29.23 17.9,44.3 18.32,44.72 LVL1.P$41
LIN17
  Top 0.127: MAX10.B7 18.51,26.62 18.9,27 18.91,27.84 17.64,29.11 17.64,44.42 18.34,45.12 LVL1.P$42
LIN18
  Top 0.127: LVL1.P$45 19.18,46.3 18.13,46.3 18.09,46.27 17.95,46.13 17.95,45.14 17.39,44.58 17.39,28.98 18.51,27.86 MAX10.A7
LIN19
  Top 0.127: MAX10.B6 17.71,26.61 18.11,27.05 18.11,27.88 17.14,28.85 17.14,44.7 17.64,45.21 17.64,46.35 18.01,46.72 LVL1.P$46
LVL0
  Top 0.203: POKEYMAX.38 26.03,45.49 26.03,46.74 25.11,47.65 25.11,48.84 24.83,49.12 19.93,49.12 19.32,48.41 16.22,48.41 14.93,47.12 LVL1.P$2
LVL1
  Top 0.203: POKEYMAX.39 26.05,48.64 24.98,49.71 21.4,49.71 21.1,49.53 19.04,49.53 18.48,48.84 13.25,48.84 12.41,47.95 12.44,47.93 12.44,46.28 12.8,45.92 LVL1.P$5
LVL2
  Top 0.203: POKEYMAX.40 25.67,50.16 21.1,50.16 20.69,50.04 18.38,50.04 17.85,49.28 13.02,49.28 11.85,48.01 11.85,46.2 12.54,45.52 LVL1.P$6
LVL3
  Top 0.203: POKEYMAX.2 10.84,46.63 11.68,45.8 11.65,44.73 12.06,44.32 LVL1.P$9
LVL4
  Top 0.203: POKEYMAX.3 10.94,45.34 10.94,44.4 11.42,43.92 LVL1.P$10
LVL5
  Top 0.203: POKEYMAX.4 11.43,42.3 11.45,42.32 LVL1.P$14
LVL6
  Top 0.203: LVL1.P$17 11.54,41.12 POKEYMAX.5
LVL7
  Top 0.203: LVL1.P$18 12.44,40.72 11.9,40.18 11.9,39.75 10.81,38.66 POKEYMAX.6
LVL8
  Top 0.203: POKEYMAX.7 10.81,35.87 11.98,37.03 11.98,38.96 12.54,39.52 LVL1.P$21
LVL9
  Top 0.127: A4.1 12.88,34.94 12.08,35.74 12.08,36.61 12.36,36.9 12.36,38.81 12.67,39.12 LVL1.P$22
LVL10
  Top 0.127: LVL1.P$27 20.18,39.12 20.59,38.71 20.59,37.13 21.94,35.79
  Top 0.203: 21.94,35.79 23.18,34.54 23.18,29.87 23.38,29.67 23.38,28.85 23.59,28.65 24.02,28.04 24.02,18.59 24.78,17.8 24.78,16.43 25.14,16.08 25.14,11.82 26.05,10.91 POKEYMAX.24
LVL11
  Top 0.127: LVL1.P$28 20.19,39.52 20.84,38.86 20.84,37.49 20.86,37.48
  Top 0.152: 21.68,36.65 20.86,37.48
  Top 0.203: POKEYMAX.26 26.05,16.05 25.16,16.94 25.16,18.03 24.4,18.8 24.4,28.45 23.99,29.06 23.79,29.26 23.79,29.87 23.59,30.07 23.59,34.75 21.68,36.65
LVL12
  Top 0.127: LVL1.P$31 20.18,40.72 22.19,38.71
  Top 0.203: POKEYMAX.27 26.05,17.86 24.81,18.9 24.81,29.46 24.4,30.07 23.99,30.48 23.99,34.95 22.22,36.73 22.22,38.68 22.19,38.71
LVL13
  Top 0.127: LVL1.P$32 20.21,41.12 21.68,39.65 22.14,39.65 22.7,39.09
  Top 0.203: POKEYMAX.28 26.05,21.11 25.21,21.95 25.21,30.07 24.4,30.89 24.4,35.15 24.38,35.15 22.7,36.83 22.7,39.09
LVL14  (via drill 0.36)
  Top 0.127: 21.53,40.41 21.53,41.05 21.35,41.22 21.35,41.66 21.1,41.91 20.67,41.91 20.26,42.32 LVL1.P$35
  Top 0.152: 21.99,39.95 21.53,40.41
  Top 0.178: 22.8,39.95 21.99,39.95
  Top 0.203: POKEYMAX.29 26.05,23.82 26.89,24.66 26.89,33.19 v26.06,34.02 | v24.04,36.25 23.26,37.03 23.26,39.5 22.8,39.95
  Bottom 0.203: v24.04,36.25 25.01,35.53 25.01,34.95 25.94,34.02 v26.06,34.02
LVL15
  Top 0.152: LVL1.P$39 20.71,43.92 21.23,43.41 21.23,42.49 21.71,42.01 21.71,41.43 21.94,41.2 21.94,40.84 22.09,40.69
  Top 0.203: POKEYMAX.32 26.03,30.25 26.03,30.89 25.21,31.7 25.21,34.34 24.81,34.75 24.81,36.45 23.87,37.39 23.87,39.62 23.08,40.41 22.37,40.41 22.09,40.69
LVL16
  Top 0.152: 24.27,39.78 24.68,40.21 24.68,43.59 24.5,43.79 21.28,43.79 20.75,44.32 LVL1.P$40
  Top 0.203: 26.03,32.79 POKEYMAX.33 25.54,33.22 25.54,34.57 25.22,34.95 25.21,34.95 25.21,36.58 24.27,37.52 24.27,39.78
LVL17
  Top 0.152: 25.67,35.69 25.67,36.8 24.96,37.54 24.96,43.89 24.68,44.15 21.4,44.15 21.28,44.27 21.28,44.63 20.67,45.24 20.38,45.52 LVL1.P$43
  Top 0.203: 25.67,35.69 POKEYMAX.34
LVL18
  Top 0.152: 20.92,47.4 24.53,47.4 24.88,47.04 24.88,44.88 25.24,44.55 25.24,38.68 25.7,38.2
  Top 0.203: 25.82,38.08 POKEYMAX.35 25.7,38.2 | 20.92,47.4 20.44,46.86 20.44,46.15 20.2,45.92 LVL1.P$44
LVL19
  Top 0.152: 25.19,47.02 25.19,47.14 24.58,47.75 20.74,47.75 20.26,47.24 20.14,47.12 LVL1.P$47
  Top 0.203: 25.19,47.02 25.19,45.03 27.09,43.13 27.09,42.62 26.08,41.6 26.08,40.41 POKEYMAX.36
N$15  (via drill 0.36)
  Top 0.203: v22.52,34.14 22.52,33.26 AND1.1
  Bottom 0.203: POKEYMAX.31 25.98,27.69 23.99,29.67 23.99,34.01 23.66,34.34 22.72,34.34 v22.52,34.14
N$16  (via drill 0.36)
  Top 0.203: v22.77,29.46 22.57,29.99 AND1.6
  Bottom 0.203: POKEYMAX.30 25.67,25.15 24.6,26.21 24.6,28.25 23.38,29.46 v22.77,29.46
N$137
  Top 0.406: REG1.5 5.53,46.92 4.44,48.01 4.44,49.13 L1.1
NSTATUS  (via drill 0.25, 0.36)
  Top 0.127: RN2.7 7.44,35.94 8.25,35.94 8.53,35.71 8.53,33.74 7.22,32.43 7.22,31.03 8.12,30.12 8.12,26.75 v7.94,26.57
  Top 0.203: MAX10.C4 16.11,25.69 v15.71,25.35
  Bottom 0.127: v15.71,25.35 15.31,25.32 14.14,26.49 8.47,26.52 7.99,26.52 v7.94,26.57
PIN0
  Top 0.127: MAX10.N2 14.51,17.44 15.08,16.87 15.08,16.48 16.07,15.5 COMP1.13
PIN1
  Top 0.127: MAX10.M3 15.31,18.54 14.91,18.16 14.91,17.54 15.38,17.07 15.38,16.66 16.7,15.35 COMP1.12
PIN2
  Top 0.127: MAX10.M2 14.11,18.16 14.11,17.35 14.52,16.94 14.52,16.54 15.54,15.52 COMP1.14
PIN3
  Top 0.127: MAX10.M1 13.71,18.44 13.3,18.03 13.3,16.74 13.55,16.54 13.88,16.54 14.9,15.46 COMP1.1
PIN4
  Top 0.127: MAX10.M4 16.11,18.45 16.5,18.06 16.5,17.45 17,16.99 17.15,16.84 18.74,16.84 19.77,15.8 19.77,15.55 COMP2.13
PIN5
  Top 0.127: MAX10.N5 16.91,17.58 17.17,17.33 17.35,17.14 18.91,17.14 20.41,15.65 20.41,15.42 COMP2.12
PIN6
  Top 0.127: COMP2.14 19.3,15.74 18.51,16.54 17,16.54 16.97,16.51 16.35,17.09 16.11,17.34 MAX10.N4
PIN7
  Top 0.127: 15.34,17.67 15.34,17.75 MAX10.N3 15.31,17.7 16.8,16.2 18.2,16.2 18.66,15.74 COMP2.1
POT0
  Top 0.127: 14.9,6.73 RA1.P$10 14.85,6.57 14.85,7.19 14.47,7.57 14.29,7.57 13.15,8.81 13.15,14.38 12.74,14.78 12.74,25.4 11.95,26.19 11.95,28.22 10.81,29.36 POKEYMAX.9
POT1
  Top 0.127: 15.4,6.64 RA1.P$9 15.41,7.11 14.57,7.95 14.29,7.95 13.4,8.94 13.4,14.53 12.99,14.94 12.99,25.58 12.21,26.36 12.21,28.45 11.7,28.96 11.7,30.86 10.81,31.75 | 10.84,32.79 POKEYMAX.8 10.81,31.75 | 10.81,31.75 10.79,31.77
POT2
  Top 0.127: 14.4,6.85 RA1.P$11 14.39,7.11 14.19,7.32 14.01,7.32 12.89,8.56 12.89,14.25 12.46,14.68 12.46,25.15 12.44,25.15 10.84,26.75 10.84,27.66 POKEYMAX.10
POT3
  Top 0.127: RA1.P$12 13.9,6.92 12.64,8.31 12.64,14.05 12.18,14.5 12.18,23.77 POKEYMAX.11
POT4
  Top 0.127: RA1.P$13 13.4,7.01 12.39,8.13 12.39,13.84 11.9,14.33 11.9,21.51 POKEYMAX.12
POT5
  Top 0.127: RA1.P$14 12.9,7.08 12.13,7.98 12.13,13.66 11.62,14.17 11.62,19.25 POKEYMAX.13
POT6
  Top 0.127: RA1.P$15 12.4,7.19 11.88,7.87 11.88,13.54 10.99,14.43 10.99,14.81 POKEYMAX.15
POT7
  Top 0.127: 11.79,6.63 RA1.P$16 | 11.87,6.55 RA1.P$16 | POKEYMAX.14 10.35,17.07 10.35,15.8 10,15.44 10,14.48 10.48,13.99 10.99,13.99 11.62,13.36 11.62,6.9 RA1.P$16
POTCH0  (via drill 0.25)
  Top 0.127: 20.57,11.03 CN3.1 20.92,11.16 20.92,11.3 21.53,11.91 21.53,13.36 20.92,13.95 COMP2.10
  Top 0.152: IOEXT.1 17.22,5.72 | RA1.P$8 16.29,4.92 v17.01,5.64
  Top 0.203: 17.22,5.72 17.09,5.72 v17.01,5.64 | CN3.1 20.68,10.17 v20.69,10.16
  Bottom 0.152: v20.69,10.16 20.69,9.93 19.27,8.51 19.27,8 18.38,7.11 17.78,7.11 17.42,6.75 17.42,6.05 v17.01,5.64 17.09,5.71
POTCH1  (via drill 0.25)
  Top 0.127: 19.9,10.97 CN3.2 19.85,11.51 20.43,12.34 COMP2.8
  Top 0.152: IOEXT.2 17.92,5.16 17.34,5.16 16.07,3.89 16.07,3.38 15.74,3.05 15.15,3.05 v15.08,3.12 14.9,3.3 RA1.P$7
  Top 0.203: CN3.2 v19.85,10.16
  Bottom 0.152: v19.85,10.16 18.94,8.99 16.96,8.99 14.9,6.93 14.9,3.3 v15.08,3.12
POTCH2  (via drill 0.25)
  Top 0.127: 19.02,11 CN3.3 | 19.02,10.99 CN3.3 | COMP2.6 19.27,11.94 19.09,11.76 CN3.3
  Top 0.152: IOEXT.3 17.96,4.7 17.39,4.7 16.53,3.83 16.53,2.79 16.37,2.64 14.52,2.64 14.4,2.76 14.4,3.32 v14.39,3.33 RA1.P$6
  Top 0.203: CN3.3 v19.09,10.16
  Bottom 0.152: v14.39,3.33 14.39,7.01 16.98,9.6 18.71,9.6 19.09,9.98 v19.09,10.16
POTCH3  (via drill 0.25)
  Top 0.127: CN3.4 18.23,10.96 18.23,11.91 18,12.14 18,13.41 18.13,13.54 COMP2.4
  Top 0.152: IOEXT.4 17.93,4.17 17.36,4.17 16.91,3.71 16.91,2.49 16.7,2.29 14.06,2.29 13.9,2.45 v13.9,2.81 v13.91,2.82 RA1.P$5
  Top 0.203: CN3.4 18.27,10.17 v18.28,10.16
  Bottom 0.152: v18.28,10.16 17.03,10.16 13.88,7.01 13.88,2.85 v13.91,2.82
POTCH4  (via drill 0.25)
  Top 0.127: COMP1.10 17.11,13.95 17.24,13.87 17.47,13.64 17.47,12.09 16.3,10.92 CN2.1
  Top 0.152: 13.4,2.24 13.4,2.23 | IOEXT.5 17.92,3.66 17.44,3.66 17.24,3.45 17.24,2.26 16.93,1.96 13.68,1.96 13.4,2.23 | 13.4,2.23 v13.4,3.3 RA1.P$4
  Top 0.203: CN2.1 16.29,10.2 v16.25,10.16
  Bottom 0.152: v16.25,10.16 16.25,9.93 13.4,7.09 RA1.P$4 v13.4,3.3
POTCH5  (via drill 0.25)
  Top 0.127: CN2.2 15.46,11.4 15.59,11.51 15.97,11.51 16.3,11.86 16.7,12.26 COMP1.8
  Top 0.152: IOEXT.6 18.05,3.15 18.05,2.16 17.52,1.63 13.25,1.63 12.9,1.97 v12.9,2.81 v12.89,2.82 RA1.P$3
  Top 0.203: CN2.2 15.46,10.19 v15.43,10.16
  Bottom 0.152: v15.43,10.16 15.43,9.75 12.92,7.24 12.92,2.85 v12.89,2.82
POTCH6  (via drill 0.25)
  Top 0.127: COMP1.6 15.56,12.83 | CN2.3 14.7,11.48
  Top 0.152: IOEXT.7 18.76,2.44 18.76,1.8 18.28,1.32 12.66,1.32 12.4,1.58 12.4,3.29 v12.39,3.3 12.39,4.91 RA1.P$2 | 15.56,12.83 15.43,12.83 15,12.39 15,12.09 14.7,11.79 14.7,11.48
  Top 0.203: CN2.3 v14.7,10.16
  Bottom 0.152: v14.7,10.16 14.7,9.65 12.41,7.37 12.41,3.33 v12.39,3.3
POTCH7  (via drill 0.25)
  Top 0.152: IOEXT.8 19.22,2.46 19.22,1.63 18.61,1.02 12.13,1.02 11.9,1.25 v11.9,3.83 RA1.P$1 | CN2.4 13.86,10.94 13.86,12.93 14.47,13.54 COMP1.4
  Top 0.203: RA1.P$1 | CN2.4 13.87,10.17 v13.86,10.16
  Bottom 0.152: v13.86,10.16 13.86,9.68 11.98,7.75 11.98,3.86 v11.9,3.83
TCK  (via drill 0.25)
  Top 0.127: MAX10.G2 v14.1,22.95
  Top 0.203: JTAG.1 1.79,29.37 R1.1
  Bottom 0.127: v14.1,22.95 12.28,22.91 11.14,21.77 8.58,21.77 8.53,21.82 | JTAG.1 3.33,27.81 4.97,26.11 4.97,24.5 5.41,24.12 6.07,24.12 6.19,24
  Bottom 0.152: 8.53,21.82 8.37,21.82 6.19,24
TDI  (via drill 0.25)
  Top 0.127: MAX10.F5 16.87,23.36 v16.5,22.96
  Top 0.203: RN2.6 7.92,35.23 8.22,34.98 8.22,33.96 4.95,30.69 4.95,19.89 3.33,18.27 JTAG.9
  Bottom 0.127: v16.5,22.96 16.48,22.89 15.51,22.89 14.37,21.74 12.13,21.74 11.6,21.21 8.47,21.21 8.45,21.18
  Bottom 0.152: 8.45,21.18 8.14,21.18
  Bottom 0.203: 8.14,21.18 6.09,19.13 4.78,19.13 JTAG.9
TDO  (via drill 0.25)
  Top 0.127: MAX10.F6 17.71,23.33 v17.3,22.95
  Bottom 0.127: 8.47,20.9 11.75,20.9 12.13,21.29 14.67,21.29 15.87,22.48 16.86,22.48 17.3,22.92 v17.3,22.95
  Bottom 0.152: 6.32,18.75 8.47,20.9
  Bottom 0.203: JTAG.3 1.92,23.89 1.92,17.22 2.68,16.46 3.75,16.46 4.54,17.25 4.54,17.96 5.33,18.75 6.32,18.75
THRESHOLD  (via drill 0.36)
  Top 0.127: 16.07,13.31 COMP1.7 16.07,12.88
  Top 0.152: R3.2 24.21,10.26 | 24.15,10.46 23.58,10.46 v23.16,10.04
  Top 0.203: 24.15,10.46 R2.1 24.21,10.26 | COMP2.5 18.66,12.49 v18.68,12.47 | COMP1.3 v14.11,13.95 | v14.37,12.34 14.67,12.89 COMP1.5 | 16.07,12.88 16.07,12.52 v15.69,12.12 | v21.05,12.6 21.07,12.68 21.07,13.36 20.87,13.54 COMP2.9 19.93,13.54 19.8,13.41 COMP2.7 | COMP1.7 16.07,13.46 16.14,13.54 COMP1.9 | COMP2.3 17.9,13.95 v17.72,14.12
  Bottom 0.127: 18.15,12.5 18.18,12.53
  Bottom 0.203: v23.16,10.04 23.11,10.23 23.85,10.97 23.85,12.49 23.11,13.23 23.08,13.23 20.97,15.19 20.67,15.19 | v18.68,12.47 18.63,12.53 18.18,12.53 18.12,12.53 17.72,13.03 v17.72,14.12 17.72,14.73 17.26,15.19 | 20.67,15.19 17.26,15.19 | 17.26,15.19 14.57,15.19 14.11,14.73 v14.11,13.95 14.11,13.01 v14.37,12.34 14.44,12.27 v15.69,12.12 | v21.05,12.6 21.05,14.81 20.67,15.19
TMS  (via drill 0.25)
  Top 0.127: MAX10.G1 13.63,22.55 v14.11,22.16
  Top 0.203: JTAG.5 3.33,23.8 4.26,24.71 4.26,31.14 RN2.5
  Bottom 0.127: 8.37,21.51 11.42,21.51 12.11,22.2 v14.11,22.16
  Bottom 0.152: 8.37,21.51 4.52,21.51 4.24,21.79
  Bottom 0.203: 4.24,21.79 JTAG.5